# Altium project RP2040_ESP32-C3 Dev Board.PrjPcb
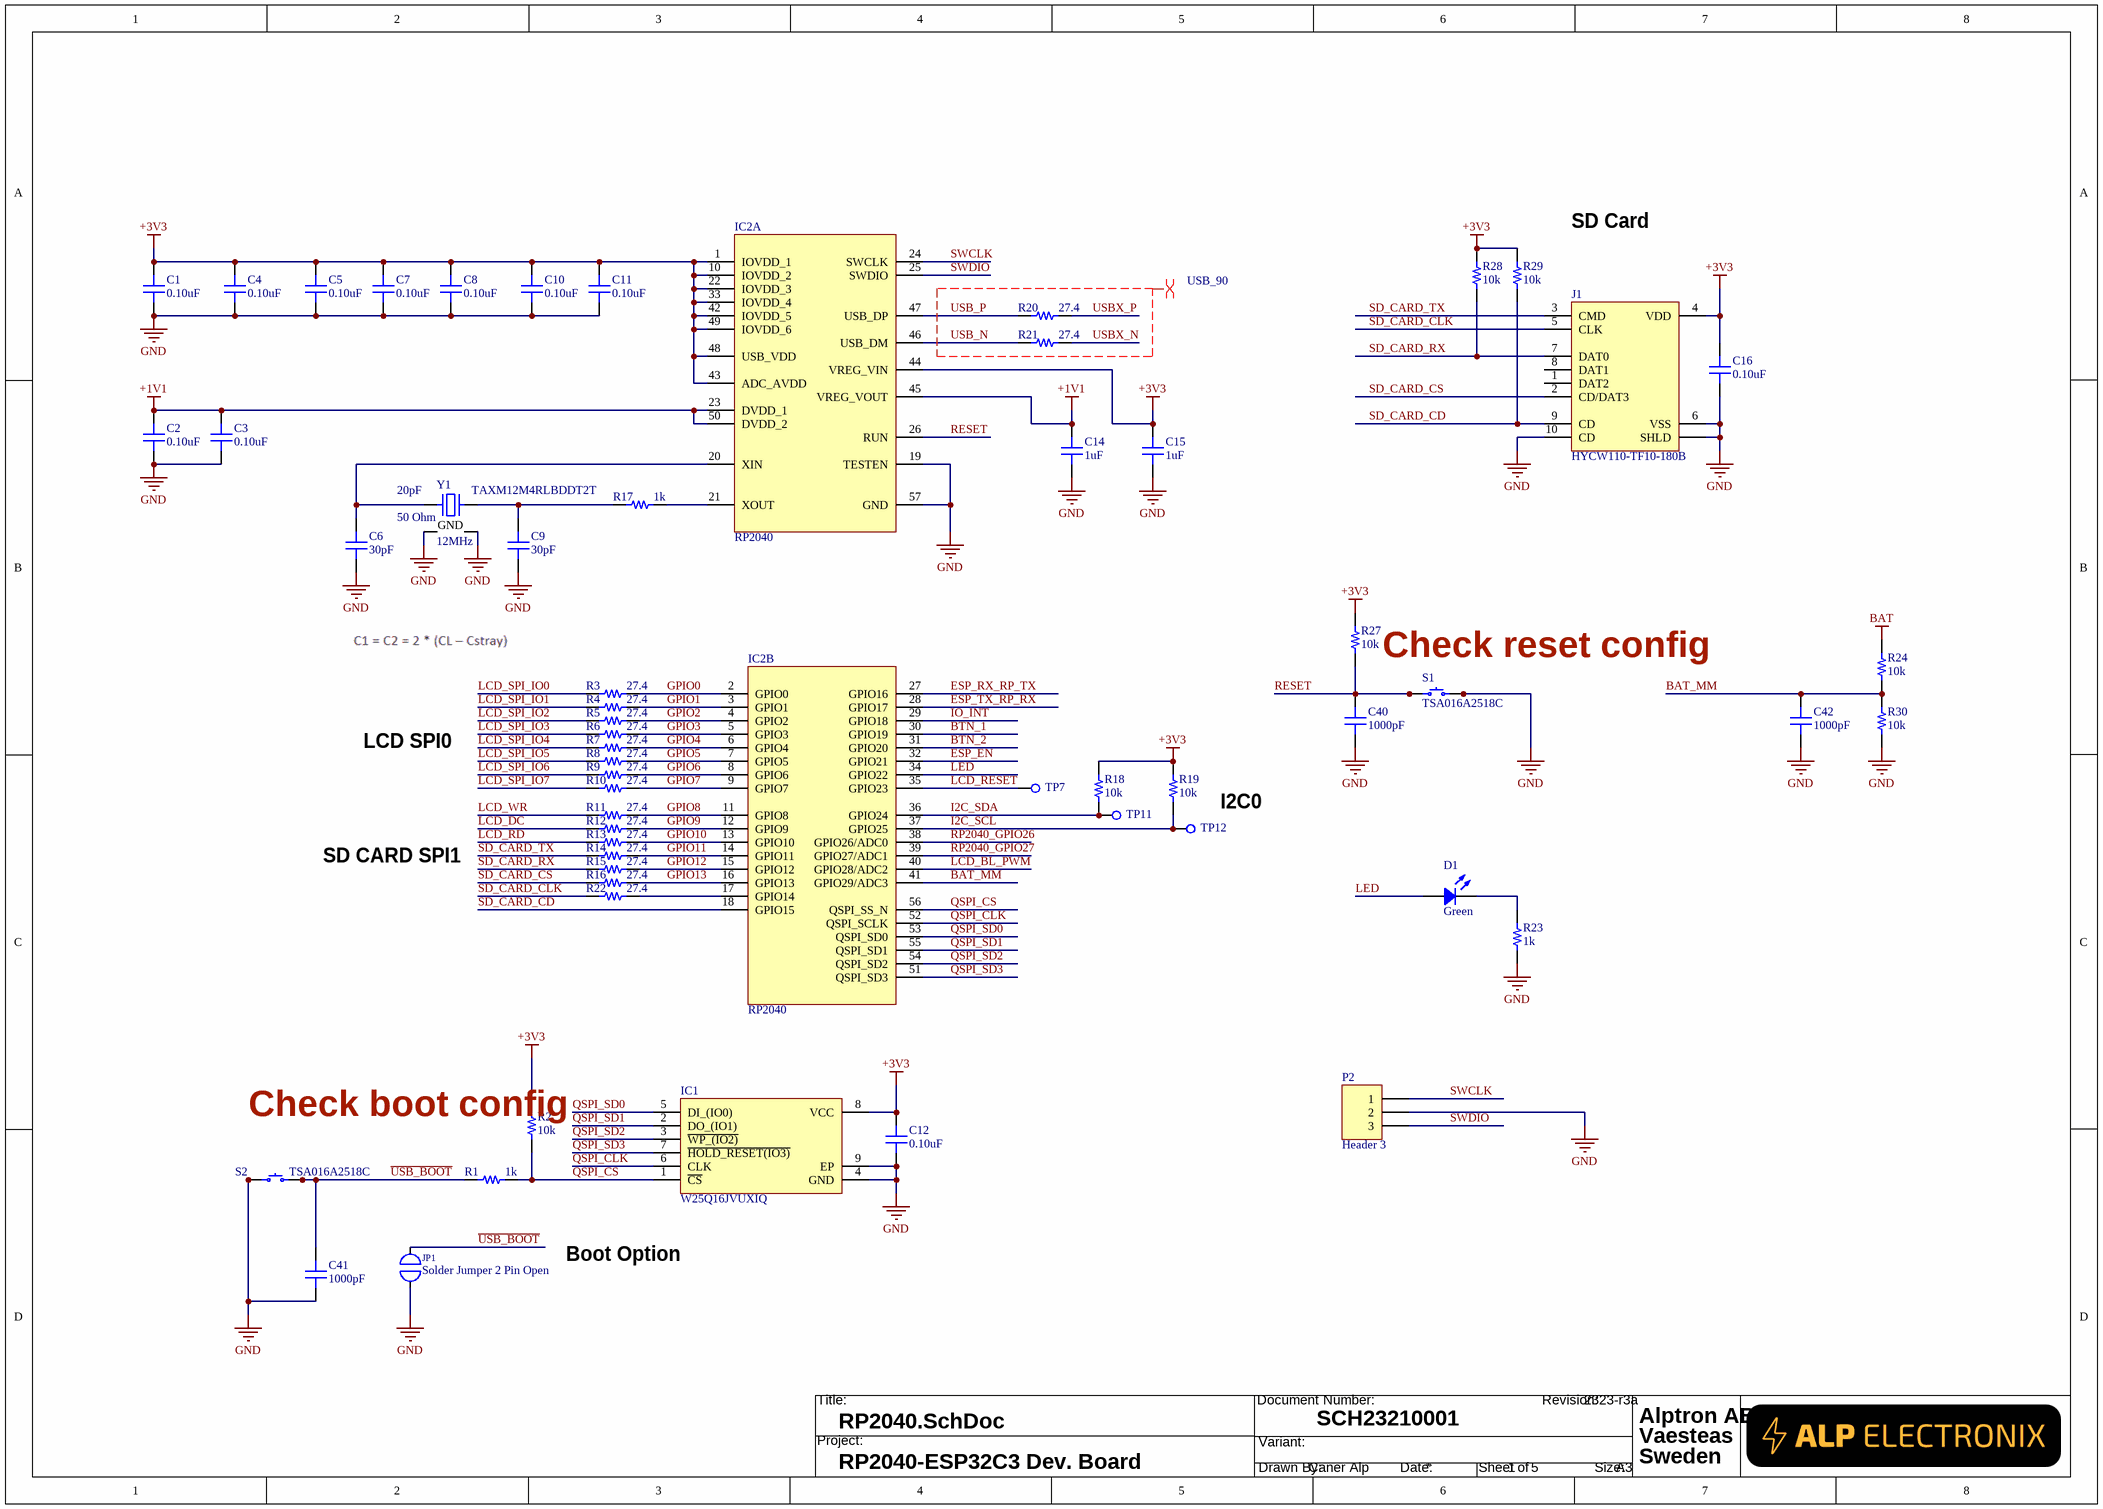
[diagram p0: RP2040.SchDoc]
DocumentCompanyNumber: SCH23210001; outputname: 4322-r1a; Project: RP2040-ESP32C3 Dev. Board; revision: 2323-r3a
5 sheets, 136 parts. Net scope: global (net labels, ports and power ports of the same name join across sheets).
Board files: RP2040_ESP32-C3 Dev Board.PcbDoc, RP2040_ESP32-C3 Dev Panel.PcbDoc, RP2040_ESP32-C3 Dev Board P&P.PcbDoc
Sheets:
  RP2040.SchDoc
  ESP32-C3 Module.SchDoc
  Power.SchDoc
  Interface.SchDoc
  Information.SchDoc

## Sheet RP2040.SchDoc
size A3; Author: Alptron AB; CompanyName: Alptron AB; DrawnBy: Caner Alp; Engineer: Caner Alp; Organization: Alptron AB; Address2: Vaesteas; Address4: Sweden; DocumentNumber: 1; SheetNumber: 1; SheetTotal: 5

### Parts
C1  0.10uF  [CAP 0402/1005]
C2  0.10uF  [CAP 0402/1005]
C3  0.10uF  [CAP 0402/1005]
C4  0.10uF  [CAP 0402/1005]
C5  0.10uF  [CAP 0402/1005]
C6  30pF  [CAP 0402/1005]
C7  0.10uF  [CAP 0402/1005]
C8  0.10uF  [CAP 0402/1005]
C9  30pF  [CAP 0402/1005]
C10  0.10uF  [CAP 0402/1005]
C11  0.10uF  [CAP 0402/1005]
C12  0.10uF  [CAP 0402/1005]
C14  1uF  [CAP 0402/1005]
C15  1uF  [CAP 0402/1005]
C16  0.10uF  [CAP 0402/1005]
C40  1000pF  [CAP 0402/1005]
C41  1000pF  [CAP 0402/1005]
C42  1000pF  [CAP 0402/1005]
D1  Green  [LED 0603/1608 GREEN]
IC1  W25Q16JVUXIQ  [SON50P300X200X60-9N]
IC2  RP2040  [QFN40P700X700X90-57N-D]  (parts A,B of 2)
J1  HYCW110-TF10-180B  [HYCW110-TF10-180B]
JP1  Solder Jumper 2 Pin Open  [SolderJumper-2_P1.3mm_Open_RoundedPad1.0x1.5mm]  (net tie, no BOM)
P2  Header 3  [3 Pads for SBW]
R1  1k  [RES 0402/1005]
R2  10k  [RES 0402/1005]
R3  27.4  [RES 0402/1005]
R4  27.4  [RES 0402/1005]
R5  27.4  [RES 0402/1005]
R6  27.4  [RES 0402/1005]
R7  27.4  [RES 0402/1005]
R8  27.4  [RES 0402/1005]
R9  27.4  [RES 0402/1005]
R10  27.4  [RES 0402/1005]
R11  27.4  [RES 0402/1005]
R12  27.4  [RES 0402/1005]
R13  27.4  [RES 0402/1005]
R14  27.4  [RES 0402/1005]
R15  27.4  [RES 0402/1005]
R16  27.4  [RES 0402/1005]
R17  1k  [RES 0402/1005]
R18  10k  [RES 0402/1005]
R19  10k  [RES 0402/1005]
R20  27.4  [RES 0402/1005]
R21  27.4  [RES 0402/1005]
R22  27.4  [RES 0402/1005]
R23  1k  [RES 0402/1005]
R24  10k  [RES 0402/1005]
R27  10k  [RES 0402/1005]
R28  10k  [RES 0402/1005]
R29  10k  [RES 0402/1005]
R30  10k  [RES 0402/1005]
S1  TSA016A2518C  [TSA016A2518C]
S2  TSA016A2518C  [TSA016A2518C]
TP7  RCT-0C  [TestPoint 1mm]  (value not drawn)  (no BOM)
TP11  RCT-0C  [TestPoint 1mm]  (value not drawn)  (no BOM)
TP12  RCT-0C  [TestPoint 1mm]  (value not drawn)  (no BOM)
Y1  12MHz  Part Number: TAXM12M4RLBDDT2T  Load Capacitance: 20pF  ESR: 50 Ohm  [NDK NX3225SA]

### Nets
+1V1: C2.2 C3.2 C14.2 IC2.23(DVDD_1) IC2.45(VREG_VOUT) IC2.50(DVDD_2)
+3V3: C1.2 C4.2 C5.2 C7.2 C8.2 C10.2 C11.2 C12.2 C15.2 C16.2 IC1.8(VCC) IC2.1(IOVDD_1) IC2.10(IOVDD_2) IC2.22(IOVDD_3) IC2.33(IOVDD_4) IC2.42(IOVDD_5) IC2.43(ADC_AVDD) IC2.44(VREG_VIN) IC2.48(USB_VDD) IC2.49(IOVDD_6) J1.4(VDD) R2.2 R18.2 R19.2 R27.2 R28.2 R29.2
BAT: R24.2
GND: C1.1 C2.1 C3.1 C4.1 C5.1 C6.1 C7.1 C8.1 C9.1 C10.1 C11.1 C12.1 C14.1 C15.1 C16.1 C40.1 C41.1 C42.1 IC1.4(GND) IC1.9(EP) IC2.19(TESTEN) IC2.57(GND) J1.6(VSS) J1.10(CD) J1.S(SHLD) JP1.1(A) P2.2 R23.1 R30.1 S1.3 S1.4 S2.1 S2.2 Y1.2(GND) Y1.4(GND)
~{USB_BOOT}: C41.2 JP1.2(B) R1.1 S2.3 S2.4
BAT_MM: C42.2 IC2.41(GPIO29/ADC3) R24.1 R30.2
BTN_1: IC2.30(GPIO19)
BTN_2: IC2.31(GPIO20)
ESP_EN: IC2.32(GPIO21)
ESP_RX_RP_TX: IC2.27(GPIO16)
ESP_TX_RP_RX: IC2.28(GPIO17)
GPIO0: IC2.2(GPIO0) R3.2
GPIO1: IC2.3(GPIO1) R4.2
GPIO2: IC2.4(GPIO2) R5.2
GPIO3: IC2.5(GPIO3) R6.2
GPIO4: IC2.6(GPIO4) R7.2
GPIO5: IC2.7(GPIO5) R8.2
GPIO6: IC2.8(GPIO6) R9.2
GPIO7: IC2.9(GPIO7) R10.2
GPIO8: IC2.11(GPIO8) R11.2
GPIO9: IC2.12(GPIO9) R12.2
GPIO10: IC2.13(GPIO10) R13.2
GPIO11: IC2.14(GPIO11) R14.2
GPIO12: IC2.15(GPIO12) R15.2
GPIO13: IC2.16(GPIO13) R16.2
I2C_SCL: IC2.37(GPIO25) R19.1 TP12.1(TP)
I2C_SDA: IC2.36(GPIO24) R18.1 TP11.1(TP)
IO_INT: IC2.29(GPIO18)
LCD_BL_PWM: IC2.40(GPIO28/ADC2)
LCD_DC: R12.1
LCD_RD: R13.1
LCD_RESET: IC2.35(GPIO23) TP7.1(TP)
LCD_SPI_IO0: R3.1
LCD_SPI_IO1: R4.1
LCD_SPI_IO2: R5.1
LCD_SPI_IO3: R6.1
LCD_SPI_IO4: R7.1
LCD_SPI_IO5: R8.1
LCD_SPI_IO6: R9.1
LCD_SPI_IO7: R10.1
LCD_WR: R11.1
LED: D1.1 IC2.34(GPIO22)
QSPI_CLK: IC1.6(CLK) IC2.52(QSPI_SCLK)
QSPI_CS: IC1.1(~{CS}) IC2.56(QSPI_SS_N) R1.2 R2.1
QSPI_SD0: IC1.5(DI_(IO0)) IC2.53(QSPI_SD0)
QSPI_SD1: IC1.2(DO_(IO1)) IC2.55(QSPI_SD1)
QSPI_SD2: IC1.3(~{WP_(IO2)}) IC2.54(QSPI_SD2)
QSPI_SD3: IC1.7(~{HOLD}~{_RESET(IO3)}) IC2.51(QSPI_SD3)
RESET: C40.2 IC2.26(RUN) R27.1 S1.1 S1.2
RP2040_GPIO26: IC2.38(GPIO26/ADC0)
RP2040_GPIO27: IC2.39(GPIO27/ADC1)
SD_CARD_CD: IC2.18(GPIO15) J1.9(CD) R29.1
SD_CARD_CLK: J1.5(CLK) R22.1
SD_CARD_CS: J1.2(CD/DAT3) R16.1
SD_CARD_RX: J1.7(DAT0) R15.1 R28.1
SD_CARD_TX: J1.3(CMD) R14.1
SWCLK: IC2.24(SWCLK) P2.1
SWDIO: IC2.25(SWDIO) P2.3
USB_N: IC2.46(USB_DM) R21.1
USB_P: IC2.47(USB_DP) R20.1
USBX_N: R21.2
USBX_P: R20.2
NetC6_2: C6.2 IC2.20(XIN) Y1.1
NetC9_2: C9.2 R17.1 Y1.3
NetD1_2: D1.2 R23.2
NetIC2_17: IC2.17(GPIO14) R22.2
NetIC2_21: IC2.21(XOUT) R17.2

Not connected (* = marked no-connect by the designer): J1 1(DAT2) 8(DAT1)

### Layout directives
differential pair; differential pair class USB_90: USB_N, USB_P, USBX_N, USBX_P

### Notes on the sheet
- SD Card
- Check reset config
- LCD SPI0
- I2C0
- SD CARD SPI1
- (near R2) Check boot config
- Boot Option
- Title:
- Project:
- Document Number:
- Variant:
- Revision:
- Drawn By:
- Date:
- Sheet
- of
- Size:
- A3

### Library data of the parts
C1-C5 C7 C8 C10-C12 C16 = LMK105BJ104KV-F: CAP CER 0.1UF 10V X5R 0402; Manufacturer: Taiyo Yuden; TemperatureRange: -55C ~ 85C; Tolerance: 10%; Value: 0.10uF; Part Number: LMK105BJ104KV-F; PartId: 12322; Supplier 1: Digi-Key; Supplier Part Number 1: 587-1227-2-ND; ComponentLink1Description: Datasheet; ComponentLink1URL: http://ds.yuden.co.jp/TYCOMPAS/ut/detail.do?productNo=LMK105BJ104KV-F&fileName=LMK105BJ104KV-F_SS&mode=specSheetDownload; ComponentLink2Description: Digi-Key Listing; ComponentLink2URL: https://www.digikey.com/product-detail/en/taiyo-yuden/LMK105BJ104KV-F/587-1227-2-ND/930579; TemperatureCoefficient: X5R; Voltage: 10V; Price: 0,0021; Device Package: 0402 (1005 Metric)
C6 C9 = GRM1555C1H300JA01D: CAP CER 30PF 50V NP0 0402; Manufacturer: Murata Electronics North America; TemperatureRange: -55C ~ 125C; TemperatureCoefficient: C0G, NP0; Tolerance: 5%; Value: 30pF; Part Number: GRM1555C1H300JA01D; PartId: 5055; Supplier 1: Digi-Key; Supplier Part Number 1: 490-5935-2-ND; ComponentLink1Description: Datasheet; ComponentLink1URL: http://www.murata.com/~/media/webrenewal/support/library/catalog/products/capacitor/mlcc/c02e.ashx; ComponentLink2Description: Digi-Key listing; ComponentLink2URL: http://digikey.com/product-detail/en/GRM1555C1H300JA01D/490-5935-2-ND/3693845; Voltage: 50V; Price: 0,0118; Type: -; Device Package: 0402 (1005 Metric)
C14 C15 = GRM155R70J105KA12D: CAP CER 1UF 6.3V X7R 0402; Manufacturer: Murata Electronics North America; TemperatureRange: -55C ~ 125C; Tolerance: 10%; Type: Derating Recommended; Value: 1uF; Part Number: GRM155R70J105KA12D; PartId: 5157; Supplier 1: Digi-Key; Supplier Part Number 1: 490-10024-2-ND; ComponentLink1Description: Datasheet; ComponentLink1URL: http://www.murata.com/~/media/webrenewal/support/library/catalog/products/capacitor/mlcc/c02e.ashx; ComponentLink2Description: Digi-Key listing; ComponentLink2URL: http://digikey.com/product-detail/en/GRM155R70J105KA12D/490-10024-2-ND/5027109; TemperatureCoefficient: X7R; Voltage: 6.3V; Price: 0,019; Device Package: 0402 (1005 Metric)
C40-C42 = C1005C0G1H102J050BA: CAP CER 1000PF 50V C0G 0402; Manufacturer: TDK Corporation; TemperatureRange: -55C ~ 125C; TemperatureCoefficient: C0G, NP0; Tolerance: 5%; Value: 1000pF; Part Number: C1005C0G1H102J050BA; PartId: 3861; Supplier 1: Digi-Key; Supplier Part Number 1: 445-6846-2-ND; ComponentLink1Description: Datasheet; ComponentLink1URL: https://product.tdk.com/info/en/catalog/datasheets/mlcc_commercial_general_en.pdf; ComponentLink2Description: Digi-Key listing; ComponentLink2URL: http://digikey.com/product-detail/en/C1005C0G1H102J050BA/445-6846-2-ND/2619187; Voltage: 50V; Price: 0,0287; Type: -; Device Package: 0402 (1005 Metric)
D1 = HSMQ-C191: LED GREEN DIFFUSED 0603 SMD; Manufacturer: Avago Technologies US Inc.; Type: Surface Mount; Millicandela: 145mcd; Voltage Forward: 3.4V; Current (Test): 20mA; Viewing Angle: 140; Value: Green; Part Number: HSMQ-C191; PartId: 7059; Supplier 1: Digi-Key; Supplier Part Number 1: 516-1807-2-ND; ComponentLink1Description: Datasheet; ComponentLink1URL: http://www.avagotech.com/docs/AV02-0977EN; ComponentLink2Description: Digi-Key Listing; ComponentLink2URL: http://www.digikey.ca/product-detail/en/HSMQ-C191/516-1807-2-ND/1012398; Price: 0,4769; Device Package: 0603 (1608 Metric); Colour: Green; Lens Transparency: Diffused
IC1 = W25Q16JVUXIQ: Integrated Circuit; Manufacturer_Name: Winbond; Datasheet Link: https://www.winbond.com/resource-files/w25q16jv%20spi%20revh%2004082019%20plus.pdf; Height: 0.6mm; Manufacturer_Part_Number: W25Q16JVUXIQ
IC2 = RP2040: Integrated Circuit; Manufacturer_Name: RASPBERRY-PI; Datasheet Link: https://datasheets.raspberrypi.org/rp2040/rp2040-datasheet.pdf; Height: 0.9mm; Manufacturer_Part_Number: RP2040
J1 = HYCW110-TF10-180B: MICRO SD PUSH/PUSH SMALL 8C; Manufacturer: SHOU HAN; Number of Positions: 9(8 + 1); Connector Type: Connector and Ejector; Part Number: HYCW110-TF10-180B; PartId: 9290; Supplier 1: LCSC; Supplier Part Number 1: C393941; ComponentLink1Description: Datasheet; ComponentLink1URL: https://datasheet.lcsc.com/szlcsc/1912111437_SHOU-HAN-TF-PUSH_C393941.pdf; ComponentLink2Description: LCSC Listing; ComponentLink2URL: https://lcsc.com/product-detail/Card-Sockets-Connectors_SHOU-HAN-TF-PUSH_C393941.html; Type: Connector and Ejector; Mounting Type: Surface Mount, Right Angle; Features: Switch; Contact Finish: Nickel
JP1 = SolderJumper_2_Open: ki_keywords: solder jumper SPST; ki_description: Solder Jumper, 2-pole, open; ki_fp_filters: SolderJumper*Open*; Supplier: ~
P2 = Header 3: Header, 3-Pin; LatestRevisionDate: 17-Jul-2002; LatestRevisionNote: Re-released for DXP Platform.; Publisher: Altium Limited
R1 R17 R23 = ERJ-2GEJ102X: RES SMD 1K OHM 5% 1/10W 0402; Manufacturer: Panasonic Electronic Components; TemperatureRange: -55C ~ 155C; TemperatureCoefficient: 200ppm/C; PowerRating: 0.1W, 1/10W; Value: 1k; Part Number: ERJ-2GEJ102X; PartId: 10982; Supplier 1: Digi-Key; Supplier Part Number 1: P1.0KJTR-ND; ComponentLink1Description: Datasheet; ComponentLink1URL: http://industrial.panasonic.com/www-cgi/jvcr13pz.cgi?E+PZ+3+AOA0001+ERJ2GEJ102X+7+WW; ComponentLink2Description: Digi-Key Listing; ComponentLink2URL: https://www.digikey.com/product-detail/en/panasonic-electronic-components/ERJ-2GEJ102X/P1.0KJTR-ND/146898; Tolerance: 5%; Price: 0,0019; Device Package: 0402 (1005 Metric)
R2 R18 R19 R24 R27-R30 = RC0402JR-0710KL: RES SMD 10K OHM 5% 1/16W 0402; Manufacturer: Yageo; TemperatureRange: -55C ~ 155C; TemperatureCoefficient: 100ppm/C; PowerRating: 0.063W, 1/16W; Value: 10k; Part Number: RC0402JR-0710KL; PartId: 14464; Supplier 1: Digi-Key; Supplier Part Number 1: 311-10KJRTR-ND; ComponentLink1Description: Datasheet; ComponentLink1URL: http://www.yageo.com/documents/recent/PYu-RC_Group_51_RoHS_L_04.pdf; ComponentLink2Description: Digi-Key Listing; ComponentLink2URL: https://www.digikey.com/product-detail/en/yageo/RC0402JR-0710KL/311-10KJRTR-ND/726418; Tolerance: 5%; Price: 0,0017; Device Package: 0402 (1005 Metric)
R3-R16 R20-R22 = ERJ-2RKF27R4X: RES SMD 27.4 OHM 1% 1/10W 0402; Manufacturer: Panasonic Electronic Components; TemperatureRange: -55C ~ 155C; TemperatureCoefficient: 100ppm/C; PowerRating: 0.1W, 1/10W; Value: 27.4; Part Number: ERJ-2RKF27R4X; PartId: 342; Supplier 1: Digi-Key; Supplier Part Number 1: P27.4LTR-ND; ComponentLink1Description: Datasheet; ComponentLink1URL: http://industrial.panasonic.com/www-cgi/jvcr13pz.cgi?E+PZ+3+AOA0002+ERJ2RKF27R4X+7+WW; ComponentLink2Description: Digikey listing; ComponentLink2URL: http://digikey.com/product-detail/en/ERJ-2RKF27R4X/P27.4LTR-ND/192262; Tolerance: 1%; Price: 0,0043; Type: Thick Film; Device Package: 0402 (1005 Metric)
S1 S2 = PTS810 SJM 250 SMTR LFS: SWITCH TACTILE SPST-NO 0.05A 16V; Manufacturer: C&K; Actuator Height off PCB, Vertical: 2.50mm; Actuator Orientation: Top Actuated; Actuator Type: Oval Button; Contact Rating @ Voltage: 0.05A @ 16VDC; Illumination: Non-Illuminated; Operating Force: 160gf; Outline: 4.20mm x 3.20mm; Switch Function: Off-Mom; Part Number: TSA016A2518C; Circuit: SPST-NO; ComponentLink1Description: Datasheet; ComponentLink1URL: https://dznh3ojzb2azq.cloudfront.net/products/Tactile/PTS810/documents/datasheet.pdf; ComponentLink2Description: DigiKey Link; ComponentLink2URL: http://digikey.com/product-detail/en/c-k/PTS810-SJM-250-SMTR-LFS/CKN10502CT-ND/4176673; LastUpdated: 2020-04-09 10:00:13; Lifecycle Status: Active; Minimum Order: 1; Mounting Type: Surface Mount; Operating Temperature: -40°C ~ 85°C; Packaging: TapeAndReel; Part Status: Active; Price: 0.16; Series: PTS810; Supplier 1: DigiKey; Supplier Part Number 1: CKN10502CT-ND; Termination Style: J Lead
TP7 TP11 TP12 = RCT-0C: 0805 PROBE PAD; Manufacturer: TE Connectivity AMP Connectors; Part Number: RCT-0C; PartId: 15704; Supplier 1: Digi-Key; Supplier Part Number 1: A106144CT-ND; ComponentLink1Description: Datasheet; ComponentLink1URL: http://www.te.com/commerce/DocumentDelivery/DDEController?Action=srchrtrv&DocNm=1773266&DocType=DS&DocLang=English; ComponentLink2Description: Digi-Key Listing; ComponentLink2URL: http://www.digikey.com/product-detail/en/te-connectivity-amp-connectors/RCT-0C/A106144CT-ND/3477801; Price: 0,14; Type: PC Test Point; Mounting Type: Surface Mount
Y1 = NX3225SA-12.000MHZ-STD-CSR-1: CRYSTAL 12.0000MHZ 8PF SMD; Manufacturer: NDK; Frequency Stability: 15ppm; Operating Mode: Fundamental; PartId: 8505; Supplier 1: LCSC; Supplier Part Number 1: 644-1047-2-ND; ComponentLink1Description: Datasheet; ComponentLink1URL: http://media.digikey.com/pdf/Data%20Sheets/NDK%20PDFs/NX3225SA.pdf; ComponentLink2Description: Digi-Key Listing; ComponentLink2URL: http://www.digikey.com/product-detail/en/NX3225SA-12.000MHZ-STD-CSR-1/644-1047-2-ND/1128829; Price: 0,3799; Type: MHz Crystal; Device Package: 4-SMD, No Lead (DFN, LCC); Frequency: 12MHz; Frequency Tolerance: 15ppm

## Sheet ESP32-C3 Module.SchDoc
size A3; Author: Alptron AB; CompanyName: Alptron AB; DrawnBy: Caner Alp; Engineer: Caner Alp; Organization: Alptron AB; Address2: Vaesteas; Address4: Sweden; DocumentNumber: 2; SheetNumber: 2; SheetTotal: 5
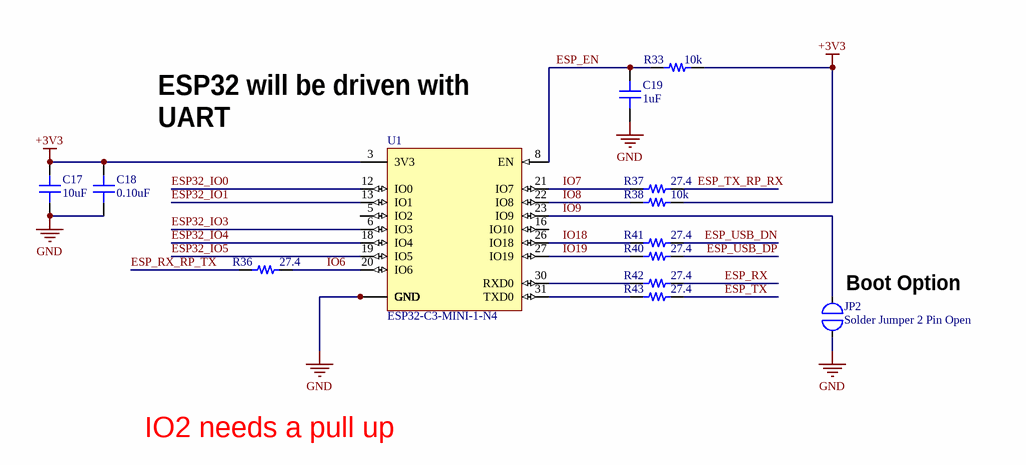
[diagram p1: ESP32-C3 Module.SchDoc]

### Parts
C17  10uF  [CAP 0603/1608]
C18  0.10uF  [CAP 0402/1005]
C19  1uF  [CAP 0402/1005]
JP2  Solder Jumper 2 Pin Open  [SolderJumper-2_P1.3mm_Open_RoundedPad1.0x1.5mm]  (net tie, no BOM)
R33  10k  [RES 0402/1005]
R36  27.4  [RES 0402/1005]
R37  27.4  [RES 0402/1005]
R38  10k  [RES 0402/1005]
R40  27.4  [RES 0402/1005]
R41  27.4  [RES 0402/1005]
R42  27.4  [RES 0402/1005]
R43  27.4  [RES 0402/1005]
U1  ESP32-C3-MINI-1-N4  [XCVR_ESP32-C3-MINI-1-N4]

### Nets
+3V3: C17.2 C18.2 R33.2 R38.2 U1.3(3V3)
GND: C17.1 C18.1 C19.1 JP2.1(A) U1.1(GND) U1.2(GND) U1.11(GND) U1.14(GND) U1.36(GND) U1.37(GND) U1.38(GND) U1.39(GND) U1.40(GND) U1.41(GND) U1.42(GND) U1.43(GND) U1.44(GND) U1.45(GND) U1.46(GND) U1.47(GND) U1.48(GND) U1.49_1(GND) U1.49_2(GND) U1.49_3(GND) U1.49_4(GND) U1.49_5(GND) U1.49_6(GND) U1.49_7(GND) U1.49_8(GND) U1.49_9(GND) U1.50(GND) U1.51(GND) U1.52(GND) U1.53(GND)
ESP32_IO0: U1.12(IO0)
ESP32_IO1: U1.13(IO1)
ESP32_IO3: U1.6(IO3)
ESP32_IO4: U1.18(IO4)
ESP32_IO5: U1.19(IO5)
ESP_EN: C19.2 R33.1 U1.8(EN)
ESP_RX: R42.2
ESP_RX_RP_TX: R36.1
ESP_TX: R43.2
ESP_TX_RP_RX: R37.2
ESP_USB_DN: R41.2
ESP_USB_DP: R40.2
IO6: R36.2 U1.20(IO6)
IO7: R37.1 U1.21(IO7)
IO8: R38.1 U1.22(IO8)
IO9: JP2.2(B) U1.23(IO9)
IO18: R41.1 U1.26(IO18)
IO19: R40.1 U1.27(IO19)
NetR42_1: R42.1 U1.30(RXD0)
NetR43_1: R43.1 U1.31(TXD0)

Not connected (* = marked no-connect by the designer): U1 4(NC) 5(IO2) 7(NC) 9(NC) 10(NC) 15(NC) 16(IO10) 17(NC) 24(NC) 25(NC) 28(NC) 29(NC) 32(NC) 33(NC) 34(NC) 35(NC)

### Notes on the sheet
- (near U1) ESP32 will be driven with UART
- (near JP2) Boot Option
- IO2 needs a pull up
- Title:
- Project:
- Document Number:
- Variant:
- Revision:
- Drawn By:
- Date:
- Sheet
- of
- Size:
- A3

### Library data of the parts
C17 = GRM188R60J106ME47D: CAP CER 10UF 6.3V X5R 0603; Manufacturer: Murata Electronics North America; TemperatureRange: -55C ~ 85C; Tolerance: 20%; Value: 10uF; Part Number: GRM188R60J106ME47D; PartId: 12950; Supplier 1: Digi-Key; Supplier Part Number 1: 490-3896-2-ND; ComponentLink1Description: Datasheet; ComponentLink1URL: http://www.murata.com/~/media/webrenewal/support/library/catalog/products/capacitor/mlcc/c02e.pdf; ComponentLink2Description: Digi-Key Listing; ComponentLink2URL: https://www.digikey.com/product-detail/en/murata-electronics-north-america/GRM188R60J106ME47D/490-3896-2-ND/965910; TemperatureCoefficient: X5R; Voltage: 6.3V; Price: 0,031; Device Package: 0603 (1608 Metric)
C18 = LMK105BJ104KV-F: as C1 on sheet RP2040; Value: 0.10uF; Part Number: LMK105BJ104KV-F; PartId: 12322; Supplier 1: Digi-Key; Supplier Part Number 1: 587-1227-2-ND; ComponentLink1Description: Datasheet; ComponentLink1URL: http://ds.yuden.co.jp/TYCOMPAS/ut/detail.do?productNo=LMK105BJ104KV-F&fileName=LMK105BJ104KV-F_SS&mode=specSheetDownload; ComponentLink2Description: Digi-Key Listing; ComponentLink2URL: https://www.digikey.com/product-detail/en/taiyo-yuden/LMK105BJ104KV-F/587-1227-2-ND/930579; TemperatureCoefficient: X5R; Voltage: 10V; Price: 0,0021; Device Package: 0402 (1005 Metric)
C19 = GRM155R70J105KA12D: as C14 on sheet RP2040; Value: 1uF; Part Number: GRM155R70J105KA12D; PartId: 5157; Supplier 1: Digi-Key; Supplier Part Number 1: 490-10024-2-ND; ComponentLink1Description: Datasheet; ComponentLink1URL: http://www.murata.com/~/media/webrenewal/support/library/catalog/products/capacitor/mlcc/c02e.ashx; ComponentLink2Description: Digi-Key listing; ComponentLink2URL: http://digikey.com/product-detail/en/GRM155R70J105KA12D/490-10024-2-ND/5027109; TemperatureCoefficient: X7R; Voltage: 6.3V; Price: 0,019; Device Package: 0402 (1005 Metric)
JP2 = SolderJumper_2_Open: as JP1 on sheet RP2040; Supplier: ~
R33 R38 = RC0402JR-0710KL: as R2 on sheet RP2040; Value: 10k; Part Number: RC0402JR-0710KL; PartId: 14464; Supplier 1: Digi-Key; Supplier Part Number 1: 311-10KJRTR-ND; ComponentLink1Description: Datasheet; ComponentLink1URL: http://www.yageo.com/documents/recent/PYu-RC_Group_51_RoHS_L_04.pdf; ComponentLink2Description: Digi-Key Listing; ComponentLink2URL: https://www.digikey.com/product-detail/en/yageo/RC0402JR-0710KL/311-10KJRTR-ND/726418; Tolerance: 5%; Price: 0,0017; Device Package: 0402 (1005 Metric)
R36 R37 R40-R43 = ERJ-2RKF27R4X: as R3 on sheet RP2040; Value: 27.4; Part Number: ERJ-2RKF27R4X; PartId: 342; Supplier 1: Digi-Key; Supplier Part Number 1: P27.4LTR-ND; ComponentLink1Description: Datasheet; ComponentLink1URL: http://industrial.panasonic.com/www-cgi/jvcr13pz.cgi?E+PZ+3+AOA0002+ERJ2RKF27R4X+7+WW; ComponentLink2Description: Digikey listing; ComponentLink2URL: http://digikey.com/product-detail/en/ERJ-2RKF27R4X/P27.4LTR-ND/192262; Tolerance: 1%; Price: 0,0043; Type: Thick Film; Device Package: 0402 (1005 Metric)
U1 = ESP32-C3-MINI-1-N4: Bluetooth, WiFi 802.11b/g/n, Bluetooth v5.0 Transceiver Module 2.412GHz ~ 2.484GHz PCB Trace Surface Mount; MF: Espressif Systems; Purchase-URL: https://pricing.snapeda.com/search/part/ESP32-C3-MINI-1-N4/?ref=eda; Value: *; Package: SMD-53 Espressif Systems; Check_prices: https://www.snapeda.com/parts/ESP32-C3-MINI-1-N4/Espressif+Systems/view-part/?ref=eda; Price: None; Availability: In Stock; MP: ESP32-C3-MINI-1-N4; SnapEDA_Link: https://www.snapeda.com/parts/ESP32-C3-MINI-1-N4/Espressif+Systems/view-part/?ref=snap

## Sheet Power.SchDoc
size A3; Author: Alptron AB; CompanyName: Alptron AB; DrawnBy: Caner Alp; Engineer: Caner Alp; Organization: Alptron AB; Address2: Vasteras; Address4: Sweden; SheetNumber: 3; SheetTotal: 5
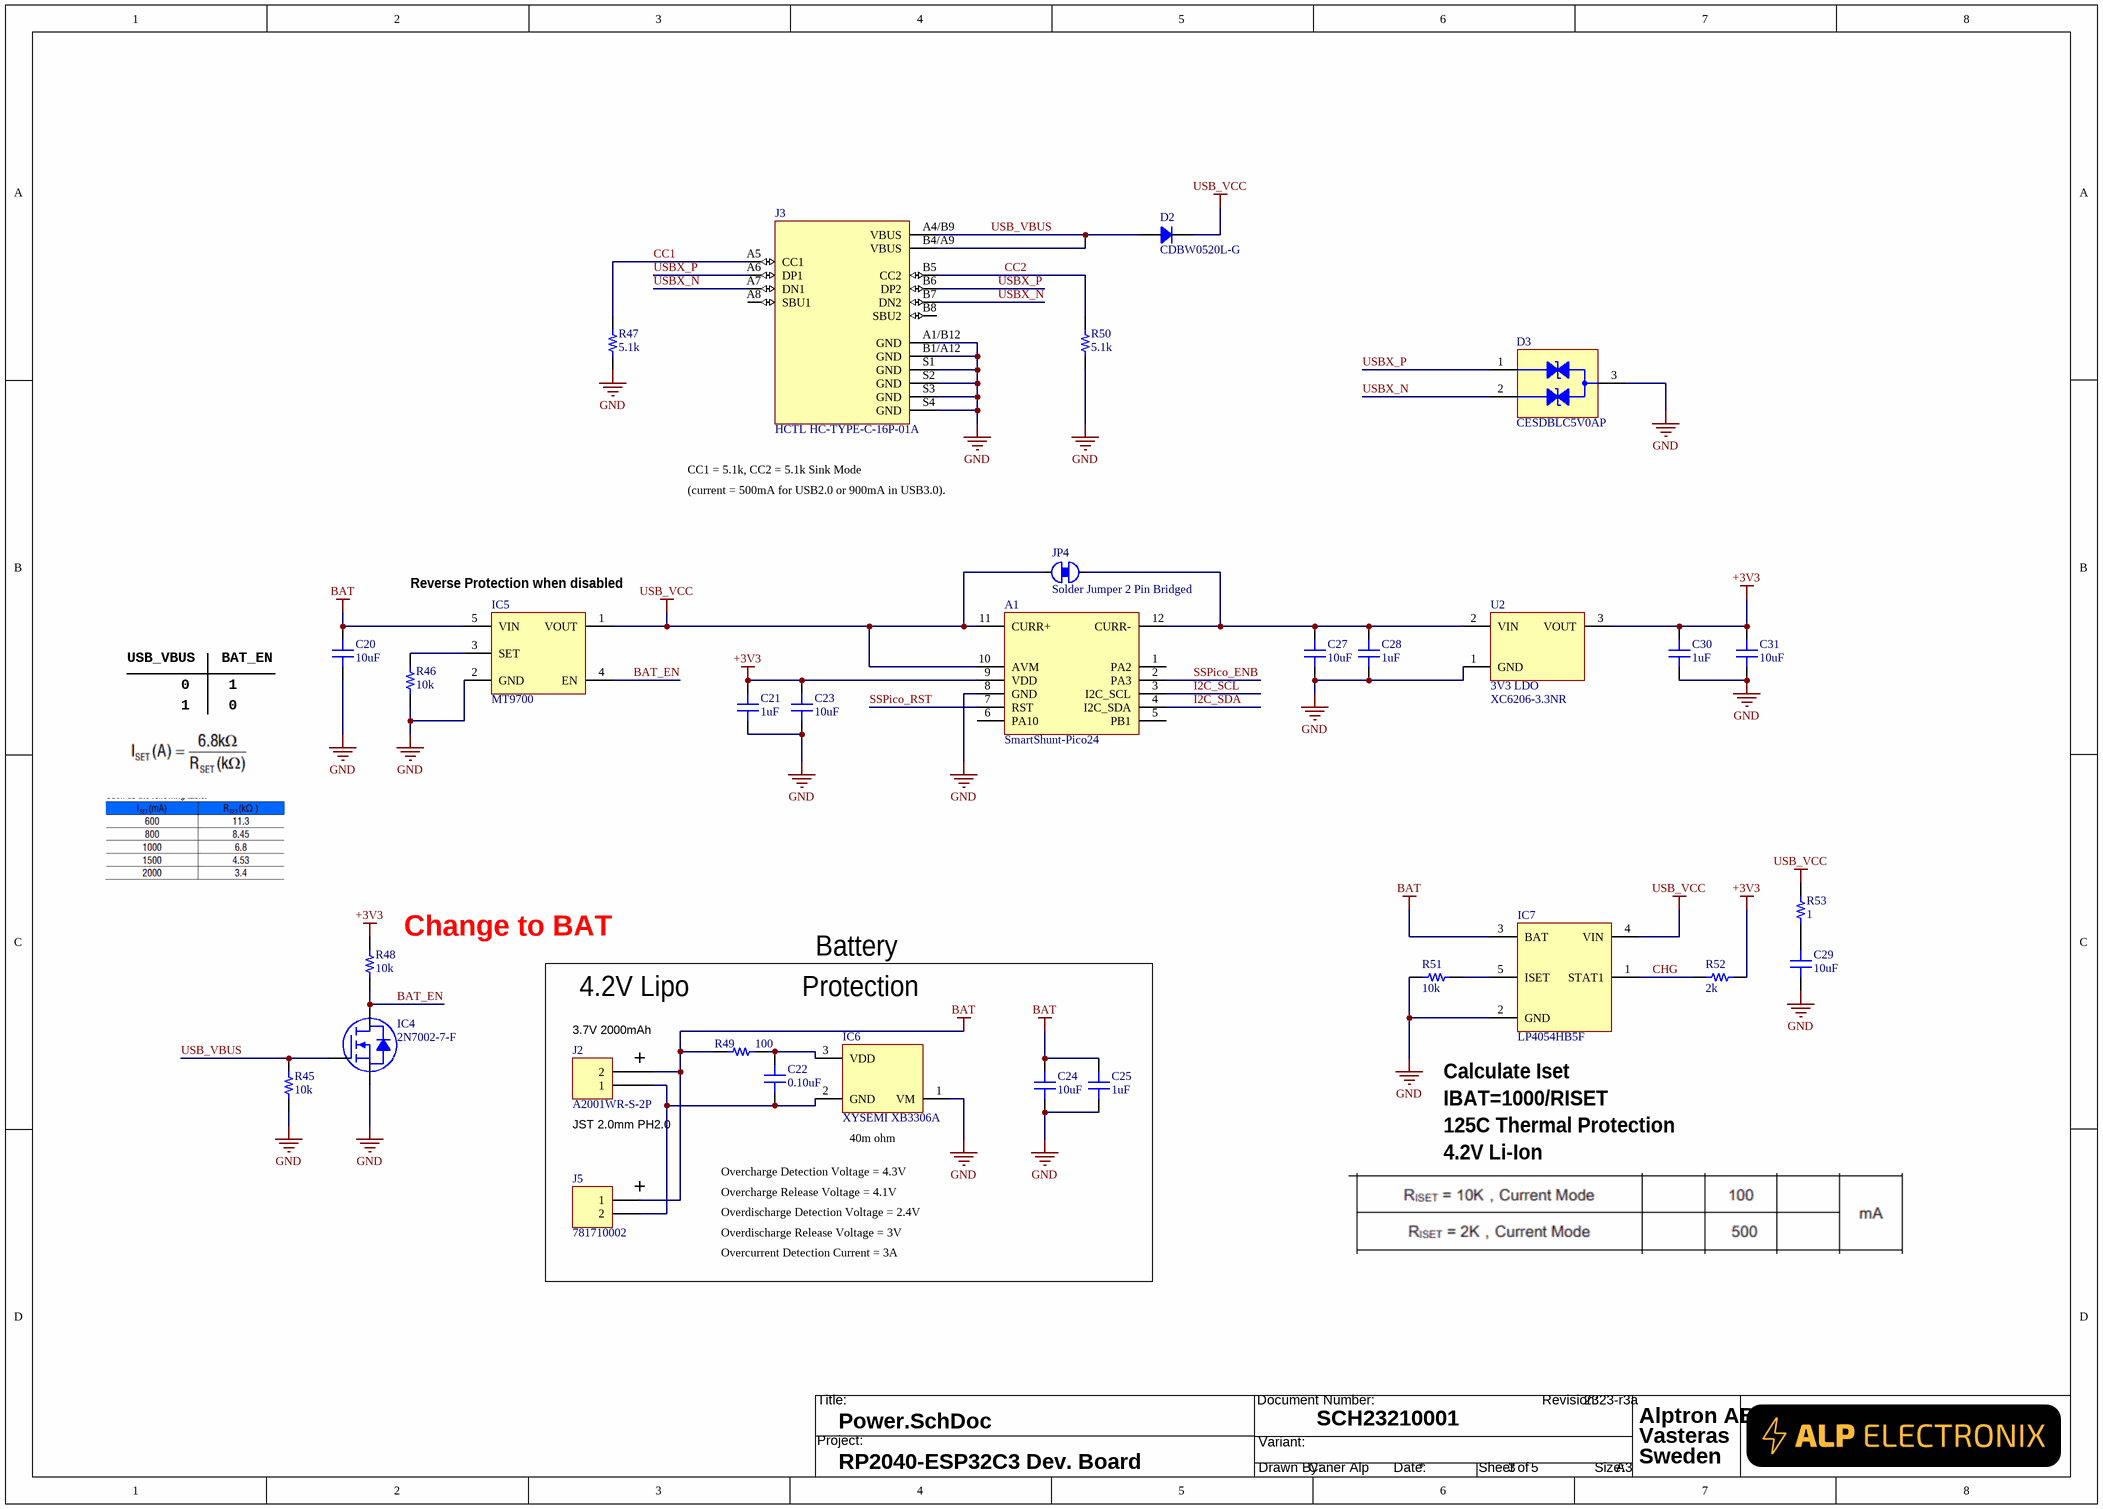
[diagram p2: Power.SchDoc]

### Parts
A1  SmartShunt-Pico24  [SmartShunt-Pico24]
C20  10uF  [CAP 0603/1608]
C21  1uF  [CAP 0402/1005]
C22  0.10uF  [CAP 0402/1005]
C23  10uF  [CAP 0603/1608]
C24  10uF  [CAP 0603/1608]
C25  1uF  [CAP 0402/1005]
C27  10uF  [CAP 0603/1608]
C28  1uF  [CAP 0402/1005]
C29  10uF  [CAP 0603/1608]
C30  1uF  [CAP 0402/1005]
C31  10uF  [CAP 0603/1608]
D2  CDBW0520L-G  [SOD-123]
D3  CESDBLC5V0AP  [ON SEMI SOT-23-3]
IC4  2N7002-7-F  [DIODES SOT-23-3]
IC5  MT9700  [DIODES SOT-23-5 W5]
IC6  XYSEMI XB3306A  [DIODES SOT-23-3]
IC7  LP4054HB5F  [DIODES SOT-23-5 W5]
J2  A2001WR-S-2P  [JST S2B-PH-SM4-TB]
J3  HCTL HC-TYPE-C-16P-01A  [HCTL HC-TYPE-C-16P-01A]
J5  781710002  [Molex 781710002]
JP4  Solder Jumper 2 Pin Bridged  [SolderJumper-2_P1.3mm_Bridged_RoundedPad1.0x1.5mm]  (net tie, no BOM)
R45  10k  [RES 0402/1005]
R46  10k  [RES 0603/1608]
R47  5.1k  [RES 0402/1005]
R48  10k  [RES 0402/1005]
R49  100  [RES 0402/1005]
R50  5.1k  [RES 0402/1005]
R51  10k  [RES 0603/1608]
R52  2k  [RES 0402/1005]
R53  1  [RES 0402/1005]
U2  3V3 LDO  [DIODES SOT-23-3]

### Nets
+3V3: A1.9(VDD) C21.2 C23.2 C30.2 C31.2 R48.2 R52.2 U2.3(VOUT)
BAT: C20.2 C24.2 C25.2 IC5.5(VIN) IC7.3(BAT) J2.2 J5.1 R49.1
GND: A1.8(GND) C20.1 C21.1 C23.1 C24.1 C25.1 C27.1 C28.1 C29.1 C30.1 C31.1 D3.3(I/O_2) IC4.3(S) IC5.2(GND) IC6.1(VM) IC7.2(GND) J3.A1/B12(GND) J3.B1/A12(GND) J3.S1(GND) J3.S2(GND) J3.S3(GND) J3.S4(GND) R45.1 R46.1 R47.1 R50.1 R51.1 U2.1(GND)
USB_VCC: A1.10(AVM) A1.11(CURR+) D2.2 IC5.1(VOUT) IC7.4(VIN) JP4.1(A) R53.2
BAT_EN: IC4.2(D) IC5.4(EN) R48.1
CC1: J3.A5(CC1) R47.2
CC2: J3.B5(CC2) R50.2
CHG: IC7.1(STAT1) R52.1
I2C_SCL: A1.3(I2C_SCL)
I2C_SDA: A1.4(I2C_SDA)
SSPico_ENB: A1.2(PA3)
SSPico_RST: A1.7(RST)
USB_VBUS: D2.1 IC4.1(G) J3.A4/B9(VBUS) J3.B4/A9(VBUS) R45.2
USBX_N: D3.2(GND) J3.A7(DN1) J3.B7(DN2)
USBX_P: D3.1(I/O_1) J3.A6(DP1) J3.B6(DP2)
NetA1_12: A1.12(CURR-) C27.2 C28.2 JP4.2(B) U2.2(VIN)
NetC22_1: C22.1 IC6.2(GND) J2.1 J5.2
NetC22_2: C22.2 IC6.3(VDD) R49.2
NetC29_2: C29.2 R53.1
NetIC5_3: IC5.3(SET) R46.2
NetIC7_5: IC7.5(ISET) R51.2

Not connected (* = marked no-connect by the designer): A1 1(PA2) 5(PB1) 6(PA10); J3 A8(SBU1) B8(SBU2)

### Notes on the sheet
- (current = 500mA for USB2.0 or 900mA in USB3.0).
- CC1 = 5.1k, CC2 = 5.1k Sink Mode
- (near IC5) Reverse Protection when disabled
- USB_VBUS
- 0
- 1
- BAT_EN
- (near R48) Change to BAT
- Battery
- (near J2) 3.7V 2000mAh
- 4.2V Lipo
- Protection
- (near J2) JST 2.0mm PH2.0
- (near J2) +
- (near IC7) Calculate Iset
- IBAT=1000/RISET
- Overcharge Detection Voltage = 4.3V
- (near IC6) 40m ohm
- 125C Thermal Protection
- 4.2V Li-Ion
- (near J5) +
- Overdischarge Detection Voltage = 2.4V
- Overcharge Release Voltage = 4.1V
- Overdischarge Release Voltage = 3V
- Overcurrent Detection Current = 3A
- Title:
- Project:
- Document Number:
- Variant:
- Revision:
- Drawn By:
- Date:
- Sheet
- of
- Size:
- A3

### Library data of the parts
A1 = SmartShunt-Pico24: Current Measurement Module
C20 C23 C24 C27 C29 C31 = GRM188R60J106ME47D: as C17 on sheet ESP32-C3 Module; Value: 10uF; Part Number: GRM188R60J106ME47D; PartId: 12950; Supplier 1: Digi-Key; Supplier Part Number 1: 490-3896-2-ND; ComponentLink1Description: Datasheet; ComponentLink1URL: http://www.murata.com/~/media/webrenewal/support/library/catalog/products/capacitor/mlcc/c02e.pdf; ComponentLink2Description: Digi-Key Listing; ComponentLink2URL: https://www.digikey.com/product-detail/en/murata-electronics-north-america/GRM188R60J106ME47D/490-3896-2-ND/965910; TemperatureCoefficient: X5R; Voltage: 6.3V; Price: 0,031; Device Package: 0603 (1608 Metric)
C21 C25 C28 C30 = GRM155R70J105KA12D: as C14 on sheet RP2040; Value: 1uF; Part Number: GRM155R70J105KA12D; PartId: 5157; Supplier 1: Digi-Key; Supplier Part Number 1: 490-10024-2-ND; ComponentLink1Description: Datasheet; ComponentLink1URL: http://www.murata.com/~/media/webrenewal/support/library/catalog/products/capacitor/mlcc/c02e.ashx; ComponentLink2Description: Digi-Key listing; ComponentLink2URL: http://digikey.com/product-detail/en/GRM155R70J105KA12D/490-10024-2-ND/5027109; TemperatureCoefficient: X7R; Voltage: 6.3V; Price: 0,019; Device Package: 0402 (1005 Metric)
C22 = LMK105BJ104KV-F: as C1 on sheet RP2040; Value: 0.10uF; Part Number: LMK105BJ104KV-F; PartId: 12322; Supplier 1: Digi-Key; Supplier Part Number 1: 587-1227-2-ND; ComponentLink1Description: Datasheet; ComponentLink1URL: http://ds.yuden.co.jp/TYCOMPAS/ut/detail.do?productNo=LMK105BJ104KV-F&fileName=LMK105BJ104KV-F_SS&mode=specSheetDownload; ComponentLink2Description: Digi-Key Listing; ComponentLink2URL: https://www.digikey.com/product-detail/en/taiyo-yuden/LMK105BJ104KV-F/587-1227-2-ND/930579; TemperatureCoefficient: X5R; Voltage: 10V; Price: 0,0021; Device Package: 0402 (1005 Metric)
D2 = CDBW0520L-G: DIODE SCHOTTKY 20V 500MA SOD123; Manufacturer: Comchip Technology; Current - Reverse Leakage @ Vr: 250 µA @ 20 V; Speed: Fast Recovery =< 500ns, > 200mA (Io); Voltage - Forward (Vf) (Max) @ If: 385 mV @ 500 mA; Part Number: CDBW0520L-G; ComponentLink1Description: Datasheet; ComponentLink1URL: http://www.comchiptech.com/admin/files/product/CDBW0520L-HF Thru824572. CDBW0540-HF RevA.pdf; ComponentLink2Description: DigiKey Link; ComponentLink2URL: https://www.digikey.com/en/products/detail/comchip-technology/CDBW0520L-G/1979670; Current - Average Rectified (Io): 500mA; Diode Type: Schottky; LastUpdated: 2022-06-30 22:48:20; Lifecycle Status: Active; Minimum Order: 1; Mounting Type: Surface Mount; Operating Temperature - Junction: 125°C (Max); Package / Case: SOD-123; Packaging: TapeAndReel; PartId: 2251; Part Status: Active; Price: 0.07; Series: -; Supplier 1: DigiKey; Supplier Part Number 1: 641-1326-1-ND; Supplier Device Package: SOD-123; Voltage - DC Reverse (Vr) (Max): 20 V
D3 = NUP2105LT1G: TVS DIODE 24V 44V SOT23-3; Manufacturer: ON Semiconductor; Bidirectional Channels: 2; Capacitance @ Frequency: 30pF @ 1MHz; Current - Peak Pulse (10/1000µs): 8A (8/20µs); Power Line Protection: No; Power - Peak Pulse: 350W; Type: Zener; Voltage - Breakdown (Min): 26.2V; Voltage - Reverse Standoff (Typ): 24V (Min); Part Number: CESDBLC5V0AP; Applications: General Purpose; ComponentLink1Description: Datasheet; ComponentLink1URL: http://www.onsemi.com/pub/Collateral/NUP2105L-D.PDF; ComponentLink2Description: DigiKey Link; ComponentLink2URL: http://digikey.com/product-detail/en/on-semiconductor/NUP2105LT1G/NUP2105LT1GOSCT-ND/1485001; Device Package: TO-236-3, SC-59, SOT-23-3; LastUpdated: 2020-03-30 16:33:57; Lifecycle Status: Active; Minimum Order: 1; Mounting Type: Surface Mount; Operating Temperature: -55°C ~ 150°C (TJ); Package / Case: TO-236-3, SC-59, SOT-23-3; Packaging: TapeAndReel; PartId: 10506; Part Status: Active; Price: 0.09; Series: -; Supplier 1: DigiKey; Supplier Part Number 1: NUP2105LT1GOSCT-ND; Supplier Device Package: SOT-23-3 (TO-236); Voltage - Clamping (Max) @ Ipp: 44V
IC4 = 2N7002-7-F: MOSFET N-CH 60V 115MA SOT23-3; Manufacturer: Diodes Incorporated; Rds On (Max) at Id, Vgs: 7.5 Ohm @ 50mA, 5V; Vgs(th) (Max) at Id: 2.5V @ 250uA; Input Capacitance (Ciss) at Vds: 50pF @ 25V; Power - Max: 370mW; Current Continuous Drain: 115mA (Ta); Part Number: 2N7002-7-F; PartId: 7967; Supplier 1: Digi-Key; Supplier Part Number 1: 2N7002-FDITR-ND; ComponentLink1Description: Datasheet; ComponentLink1URL: http://www.diodes.com/_files/datasheets/ds11303.pdf; ComponentLink2Description: Digi-Key Listing; ComponentLink2URL: http://www.digikey.com/product-detail/en/2N7002-7-F/2N7002-FDITR-ND/717681; Price: 0,0255; Type: MOSFET N-Channel, Metal Oxide; Device Package: TO-236-3, SC-59, SOT-23-3; Gate Charge (Qg): -; Drain to Source Voltage (Vdss): 60V; Features: Standard
IC5 = MT9700: SOT-23-5 Power Distribution Switches ROHS
IC6 = XYSEMI XB3306A: IC LITHIUM BATT PROTECT SOT23-3; Function: Protection; Battery Chemistry: Li-Ion, Li-Pol; Part Number: XYSEMI XB3306A; PartId: 16446; Manufacturer: XYSEMI; Supplier 1: LCSC; Supplier Part Number 1: C154939; ComponentLink1Description: Datasheet; ComponentLink1URL: http://www.baitaishengshi.com/uploadfile/2017/1213/20171213368970.pdf; ComponentLink2Description: LCSC Listing; ComponentLink2URL: https://lcsc.com/product-detail/Battery-Protection-ICs_XB3306A_C154939.html; Device Package: SOT-23-3
IC7 = LP4054HB5F: 600mA Standalone Linear Li-Ion Battery Charger
J2 = S2B-PH-SM4-TB(LF)(SN): CONN HEADER SMD R/A 2POS 2MM; Manufacturer: JST Sales America Inc.; Contact Length - Mating: 0.130" (3.30mm); Current Rating (Amps): 2A; Material Flammability Rating: UL94 V-0; Number of Positions: 2; Number of Positions Loaded: All; Pitch - Mating: 0.079" (2.00mm); Shrouding: Shrouded - 4 Wall; Style: Board to Cable/Wire; Voltage Rating: 100V; Part Number: S2B-PH-SM4-TB(LF)(SN); ComponentLink1Description: Datasheet; ComponentLink1URL: http://www.jst-mfg.com/product/pdf/eng/ePH.pdf; ComponentLink2Description: DigiKey Link; ComponentLink2URL: http://digikey.com/product-detail/en/jst-sales-america-inc/S2B-PH-SM4-TB-LF-SN/455-1749-1-ND/926846; Connector Type: Header; Contact Finish - Mating: Tin; Contact Finish - Post: Tin; Contact Material: Copper Alloy; Contact Shape: Square; Contact Type: Male Pin; Fastening Type: Detent Lock; Features: Solder Retention; Insulation Color: Natural; Insulation Height: 0.217" (5.51mm); Insulation Material: Polyamide (PA6T), Nylon 6T; LastUpdated: 2020-01-15 03:45:11; Lifecycle Status: Active; Minimum Order: 1; Mounting Type: Surface Mount, Right Angle; Number of Rows: 1; Operating Temperature: -25°C ~ 85°C; Packaging: TapeAndReel; PartId: 115; Part Status: Active; Price: 0.27; Series: PH; Supplier 1: DigiKey; Supplier Part Number 1: 455-1749-1-ND; Termination: Solder
J3 = HIRO TYPE-C-31-M-12: CONN USB 2.0 TYPE-C R/A SMT; Manufacturer: Hiro; Number Of Positions: 12; Part Number: HCTL HC-TYPE-C-16P-01A; PartId: 9703; Supplier 1: LCSC; Supplier Part Number 1: C165948; ComponentLink1Description: Datasheet; ComponentLink1URL: https://datasheet.lcsc.com/szlcsc/1811131825_Korean-Hroparts-Elec-TYPE-C-31-M-12_C165948.pdf; ComponentLink2Description: LCSC Listing; ComponentLink2URL: https://lcsc.com/product-detail/USB-Type-C_Korean-Hroparts-Elec-TYPE-C-31-M-12_C165948.html; Type: USB - C; Series: USB 3.0
J5 = Header 2: Pico-EZmate Wire-to-Board Header Vertical Housing Height 1.55mm with Side Friction Locks 2 Circuits; Manufacturer: Molex; Manufacturer Part Number: 78171-0002; Contact Resistance: 20mR; Number of Contacts: 2; Max Voltage Rating (DC): 5.05kV; Current Rating: 1.5A; Voltage Rating (AC): 50V; Gender: Male; Pitch: 1.2mm; Glow Wire Compliant: Non-compliant; Supplier 1: Mouser; Supplier Part Number 1: 538-78171-0002; RoHS: Yes; Category: Headers and Wire Housings; Stock 1: 144410; Pricing 1: 1=0.39, 10=0.302, 50=0.302, 100=0.225, 1000=0.179, 10000=0.139 (USD); Mounting Technology: Surface Mount; Contact Plating: Gold; Contact Material: Copper Alloy,Copper,Gold; Housing Material: Liquid Crystal Polymer; Min Operating Temperature: -25°C; Max Operating Temperature: 85°C; Number of Rows: 1; Packaging: Tape and Reel; Termination: Solder; Orientation: Vertical; Contact Gender: Female; Voltage Rating: 50V; Number of Positions: 2; Series: Pico-Ezmate; Package Quantity: 36000; Number of Circuits: 2; RoHS Compliant: Yes; Reach SVHC Compliant: Unknown; Halogen Free: Low Halogen
JP4 = SolderJumper_2_Bridged: ki_keywords: solder jumper SPST; ki_description: Solder Jumper, 2-pole, closed/bridged; ki_fp_filters: SolderJumper*Bridged*; Supplier: ~
R45 R48 = RC0402JR-0710KL: as R2 on sheet RP2040; Value: 10k; Part Number: RC0402JR-0710KL; PartId: 14464; Supplier 1: Digi-Key; Supplier Part Number 1: 311-10KJRTR-ND; ComponentLink1Description: Datasheet; ComponentLink1URL: http://www.yageo.com/documents/recent/PYu-RC_Group_51_RoHS_L_04.pdf; ComponentLink2Description: Digi-Key Listing; ComponentLink2URL: https://www.digikey.com/product-detail/en/yageo/RC0402JR-0710KL/311-10KJRTR-ND/726418; Tolerance: 5%; Price: 0,0017; Device Package: 0402 (1005 Metric)
R46 R51 = ERJ-3GEYJ103V: RES SMD 10K OHM 5% 1/10W 0603; Manufacturer: Panasonic Electronic Components; TemperatureRange: -55C ~ 155C; TemperatureCoefficient: 200ppm/C; PowerRating: 0.1W, 1/10W; Value: 10k; Part Number: ERJ-3GEYJ103V; PartId: 11175; Supplier 1: Digi-Key; Supplier Part Number 1: P10KGTR-ND; ComponentLink1Description: Datasheet; ComponentLink1URL: http://industrial.panasonic.com/www-cgi/jvcr13pz.cgi?E+PZ+3+AOA0001+ERJ3GEYJ103V+7+WW; ComponentLink2Description: Digi-Key Listing; ComponentLink2URL: https://www.digikey.com/product-detail/en/panasonic-electronic-components/ERJ-3GEYJ103V/P10KGTR-ND/135662; Tolerance: 5%; Price: 0,002; Device Package: 0603 (1608 Metric)
R47 R50 = RC0402JR-075K1L: RES SMD 5.1K OHM 5% 1/16W 0402; Manufacturer: Yageo; TemperatureRange: -55C ~ 155C; TemperatureCoefficient: 100ppm/C; PowerRating: 0.063W, 1/16W; Value: 5.1k; Part Number: RC0402JR-075K1L; PartId: 14528; Supplier 1: Digi-Key; Supplier Part Number 1: 311-5.1KJRTR-ND; ComponentLink1Description: Datasheet; ComponentLink1URL: http://www.yageo.com/documents/recent/PYu-RC_Group_51_RoHS_L_04.pdf; ComponentLink2Description: Digi-Key Listing; ComponentLink2URL: https://www.digikey.com/product-detail/en/yageo/RC0402JR-075K1L/311-5.1KJRTR-ND/726487; Tolerance: 5%; Price: 0,0017; Device Package: 0402 (1005 Metric)
R49 = RC0402JR-07100RL: RES SMD 100 OHM 5% 1/16W 0402; Manufacturer: Yageo; TemperatureRange: -55C ~ 155C; TemperatureCoefficient: 100ppm/C; PowerRating: 0.063W, 1/16W; Value: 100; Part Number: RC0402JR-07100RL; PartId: 14478; Supplier 1: Digi-Key; Supplier Part Number 1: 311-100JRTR-ND; ComponentLink1Description: Datasheet; ComponentLink1URL: http://www.yageo.com/documents/recent/PYu-RC_Group_51_RoHS_L_04.pdf; ComponentLink2Description: Digi-Key Listing; ComponentLink2URL: https://www.digikey.com/product-detail/en/yageo/RC0402JR-07100RL/311-100JRTR-ND/726415; Tolerance: 5%; Price: 0,0017; Device Package: 0402 (1005 Metric)
R52 = RC0402JR-072KL: RES SMD 2K OHM 5% 1/16W 0402; Manufacturer: Yageo; TemperatureRange: -55C ~ 155C; TemperatureCoefficient: 100ppm/C; PowerRating: 0.063W, 1/16W; Value: 2k; Part Number: RC0402JR-072KL; PartId: 14511; Supplier 1: Digi-Key; Supplier Part Number 1: 311-2.0KJRTR-ND; ComponentLink1Description: Datasheet; ComponentLink1URL: http://www.yageo.com/documents/recent/PYu-RC_Group_51_RoHS_L_04.pdf; ComponentLink2Description: Digi-Key Listing; ComponentLink2URL: https://www.digikey.com/product-detail/en/yageo/RC0402JR-072KL/311-2.0KJRTR-ND/726434; Tolerance: 5%; Price: 0,0017; Device Package: 0402 (1005 Metric)
R53 = RC0402JR-071RL: RES SMD 1 OHM 5% 1/16W 0402; Manufacturer: Yageo; TemperatureRange: -55C ~ 155C; TemperatureCoefficient: 200ppm/C; PowerRating: 0.063W, 1/16W; Value: 1; Part Number: RC0402JR-071RL; PartId: 14504; Supplier 1: Digi-Key; Supplier Part Number 1: 311-1.0JRTR-ND; ComponentLink1Description: Datasheet; ComponentLink1URL: http://www.yageo.com/documents/recent/PYu-RC_Group_51_RoHS_L_04.pdf; ComponentLink2Description: Digi-Key Listing; ComponentLink2URL: https://www.digikey.com/product-detail/en/yageo/RC0402JR-071RL/311-1.0JRTR-ND/726407; Tolerance: 5%; Price: 0,0017; Device Package: 0402 (1005 Metric)
U2 = XC6206-3.3NR: MPN: XC6206-3.3NR

## Sheet Interface.SchDoc
size A3; Author: Alptron AB; CompanyName: Alptron AB; DrawnBy: Caner Alp; Engineer: Caner Alp; Organization: Alptron AB; Address2: Vaesteas; Address4: Sweden; DocumentNumber: 4; SheetNumber: 4; SheetTotal: 5
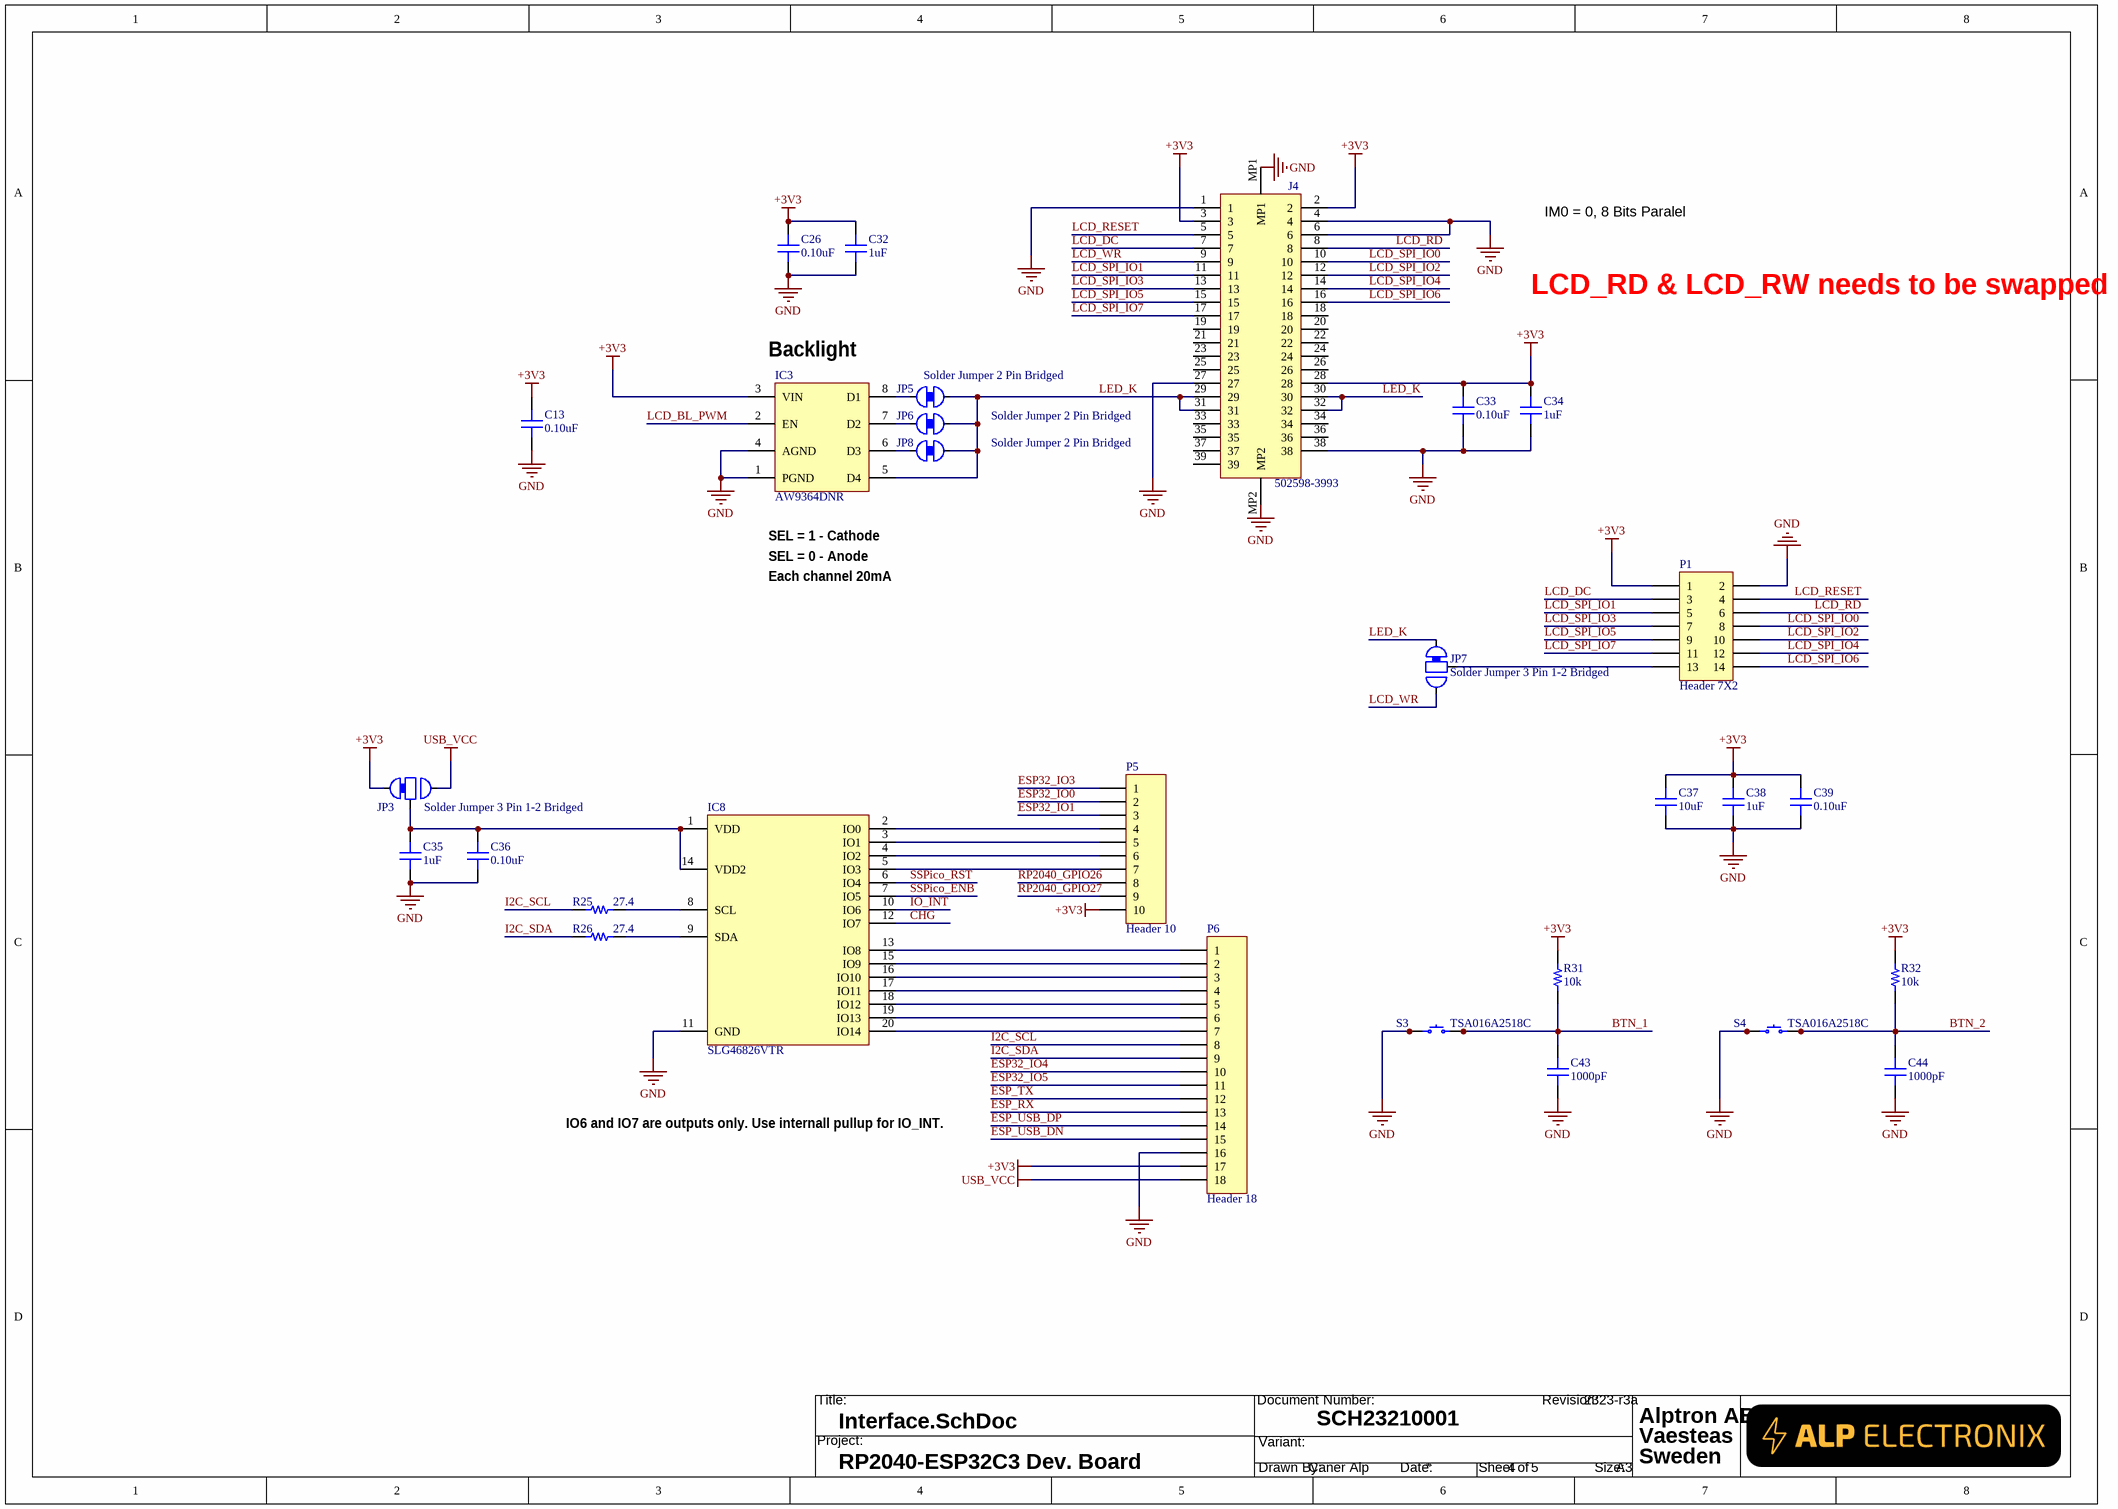
[diagram p3: Interface.SchDoc]

### Parts
C13  0.10uF  [CAP 0402/1005]
C26  0.10uF  [CAP 0402/1005]
C32  1uF  [CAP 0402/1005]
C33  0.10uF  [CAP 0402/1005]
C34  1uF  [CAP 0402/1005]
C35  1uF  [CAP 0402/1005]
C36  0.10uF  [CAP 0402/1005]
C37  10uF  [CAP 0603/1608]
C38  1uF  [CAP 0402/1005]
C39  0.10uF  [CAP 0402/1005]
C43  1000pF  [CAP 0402/1005]
C44  1000pF  [CAP 0402/1005]
IC3  AW9364DNR  [MAXIM TDFN-8 2x2MM]
IC8  SLG46826VTR  [SLG46826VTR]
J4  502598-3993  [5025983993]
JP3  Solder Jumper 3 Pin 1-2 Bridged  [SolderJumper-3_P1.3mm_Bridged12_RoundedPad1.0x1.5mm]  (net tie, no BOM)
JP5  Solder Jumper 2 Pin Bridged  [SolderJumper-2_P1.3mm_Bridged_RoundedPad1.0x1.5mm]  (net tie, no BOM)
JP6  Solder Jumper 2 Pin Bridged  [SolderJumper-2_P1.3mm_Bridged_RoundedPad1.0x1.5mm]  (net tie, no BOM)
JP7  Solder Jumper 3 Pin 1-2 Bridged  [SolderJumper-3_P1.3mm_Bridged12_RoundedPad1.0x1.5mm]  (net tie, no BOM)
JP8  Solder Jumper 2 Pin Bridged  [SolderJumper-2_P1.3mm_Bridged_RoundedPad1.0x1.5mm]  (net tie, no BOM)
P1  Header 7X2  [HDR2X7]
P5  Header 10  [Female Header 2.54mm - 10 Pin]
P6  Header 18  [Female Header 2.54mm - 18 Pin]
R25  27.4  [RES 0402/1005]
R26  27.4  [RES 0402/1005]
R31  10k  [RES 0402/1005]
R32  10k  [RES 0402/1005]
S3  TSA016A2518C  [TSA016A2518C]
S4  TSA016A2518C  [TSA016A2518C]

### Nets
+3V3: C13.2 C26.2 C32.2 C33.2 C34.2 C37.2 C38.2 C39.2 IC3.3(VIN) J4.2 J4.3 J4.28 JP3.1(A) P1.1 P5.10 P6.17 R31.2 R32.2
GND: C13.1 C26.1 C32.1 C33.1 C34.1 C35.1 C36.1 C37.1 C38.1 C39.1 C43.1 C44.1 IC3.1(PGND) IC3.4(AGND) IC8.11(GND) J4.1 J4.4 J4.6 J4.27 J4.38 J4.MP1 J4.MP2 P1.2 P6.16 S3.1 S3.2 S4.1 S4.2
USB_VCC: JP3.3(B) P6.18
BTN_1: C43.2 R31.1 S3.3 S3.4
BTN_2: C44.2 R32.1 S4.3 S4.4
CHG: IC8.12(IO7)
ESP32_IO0: P5.2
ESP32_IO1: P5.3
ESP32_IO3: P5.1
ESP32_IO4: P6.10
ESP32_IO5: P6.11
ESP_RX: P6.13
ESP_TX: P6.12
ESP_USB_DN: P6.15
ESP_USB_DP: P6.14
I2C_SCL: P6.8 R25.1
I2C_SDA: P6.9 R26.1
IO_INT: IC8.10(IO6)
LCD_BL_PWM: IC3.2(EN)
LCD_DC: J4.7 P1.3
LCD_RD: J4.8 P1.6
LCD_RESET: J4.5 P1.4
LCD_SPI_IO0: J4.10 P1.8
LCD_SPI_IO1: J4.11 P1.5
LCD_SPI_IO2: J4.12 P1.10
LCD_SPI_IO3: J4.13 P1.7
LCD_SPI_IO4: J4.14 P1.12
LCD_SPI_IO5: J4.15 P1.9
LCD_SPI_IO6: J4.16 P1.14
LCD_SPI_IO7: J4.17 P1.11
LCD_WR: J4.9 JP7.3(B)
LED_K: IC3.5(D4) J4.29 J4.30 J4.31 J4.32 JP5.2(B) JP6.2(B) JP7.1(A) JP8.2(B)
RP2040_GPIO26: P5.8
RP2040_GPIO27: P5.9
SSPico_ENB: IC8.7(IO5)
SSPico_RST: IC8.6(IO4)
NetC35_2: C35.2 C36.2 IC8.1(VDD) IC8.14(VDD2) JP3.2(C)
NetIC3_6: IC3.6(D3) JP8.1(A)
NetIC3_7: IC3.7(D2) JP6.1(A)
NetIC3_8: IC3.8(D1) JP5.1(A)
NetIC8_2: IC8.2(IO0) P5.4
NetIC8_3: IC8.3(IO1) P5.5
NetIC8_4: IC8.4(IO2) P5.6
NetIC8_5: IC8.5(IO3) P5.7
NetIC8_8: IC8.8(SCL) R25.2
NetIC8_9: IC8.9(SDA) R26.2
NetIC8_13: IC8.13(IO8) P6.1
NetIC8_15: IC8.15(IO9) P6.2
NetIC8_16: IC8.16(IO10) P6.3
NetIC8_17: IC8.17(IO11) P6.4
NetIC8_18: IC8.18(IO12) P6.5
NetIC8_19: IC8.19(IO13) P6.6
NetIC8_20: IC8.20(IO14) P6.7
NetJP7_2: JP7.2(C) P1.13

Not connected (* = marked no-connect by the designer): J4 18 19 20 21 22 23 24 25 26 33 34 35 36 37 39

### Notes on the sheet
- IM0 = 0, 8 Bits Paralel
- LCD_RD & LCD_RW needs to be swapped
- (near IC3) Backlight
- SEL = 0 - Anode
- (near IC3) SEL = 1 - Cathode
- Each channel 20mA
- IO6 and IO7 are outputs only. Use internall pullup for IO_INT.
- Title:
- Project:
- Document Number:
- Variant:
- Revision:
- Drawn By:
- Date:
- Sheet
- of
- Size:
- A3

### Library data of the parts
C13 C26 C33 C36 C39 = LMK105BJ104KV-F: as C1 on sheet RP2040; Value: 0.10uF; Part Number: LMK105BJ104KV-F; PartId: 12322; Supplier 1: Digi-Key; Supplier Part Number 1: 587-1227-2-ND; ComponentLink1Description: Datasheet; ComponentLink1URL: http://ds.yuden.co.jp/TYCOMPAS/ut/detail.do?productNo=LMK105BJ104KV-F&fileName=LMK105BJ104KV-F_SS&mode=specSheetDownload; ComponentLink2Description: Digi-Key Listing; ComponentLink2URL: https://www.digikey.com/product-detail/en/taiyo-yuden/LMK105BJ104KV-F/587-1227-2-ND/930579; TemperatureCoefficient: X5R; Voltage: 10V; Price: 0,0021; Device Package: 0402 (1005 Metric)
C32 C34 C35 C38 = GRM155R70J105KA12D: as C14 on sheet RP2040; Value: 1uF; Part Number: GRM155R70J105KA12D; PartId: 5157; Supplier 1: Digi-Key; Supplier Part Number 1: 490-10024-2-ND; ComponentLink1Description: Datasheet; ComponentLink1URL: http://www.murata.com/~/media/webrenewal/support/library/catalog/products/capacitor/mlcc/c02e.ashx; ComponentLink2Description: Digi-Key listing; ComponentLink2URL: http://digikey.com/product-detail/en/GRM155R70J105KA12D/490-10024-2-ND/5027109; TemperatureCoefficient: X7R; Voltage: 6.3V; Price: 0,019; Device Package: 0402 (1005 Metric)
C37 = GRM188R60J106ME47D: as C17 on sheet ESP32-C3 Module; Value: 10uF; Part Number: GRM188R60J106ME47D; PartId: 12950; Supplier 1: Digi-Key; Supplier Part Number 1: 490-3896-2-ND; ComponentLink1Description: Datasheet; ComponentLink1URL: http://www.murata.com/~/media/webrenewal/support/library/catalog/products/capacitor/mlcc/c02e.pdf; ComponentLink2Description: Digi-Key Listing; ComponentLink2URL: https://www.digikey.com/product-detail/en/murata-electronics-north-america/GRM188R60J106ME47D/490-3896-2-ND/965910; TemperatureCoefficient: X5R; Voltage: 6.3V; Price: 0,031; Device Package: 0603 (1608 Metric)
C43 C44 = C1005C0G1H102J050BA: as C40 on sheet RP2040; Value: 1000pF; Part Number: C1005C0G1H102J050BA; PartId: 3861; Supplier 1: Digi-Key; Supplier Part Number 1: 445-6846-2-ND; ComponentLink1Description: Datasheet; ComponentLink1URL: https://product.tdk.com/info/en/catalog/datasheets/mlcc_commercial_general_en.pdf; ComponentLink2Description: Digi-Key listing; ComponentLink2URL: http://digikey.com/product-detail/en/C1005C0G1H102J050BA/445-6846-2-ND/2619187; Voltage: 50V; Price: 0,0287; Type: -; Device Package: 0402 (1005 Metric)
IC3 = AW9364DNR: -40℃~+85℃ DFN-8(2x2) LED Drivers ROHS
IC8 = SLG46826VTR: Programmable Mixed Signal Matrix with In-System Programmability 2.048kHz/2.048MHz/25MHz Oscillators 20-Pin STQFN; Manufacturer_Name: Dialog Semiconductor; Manufacturer: Renesas; Datasheet Link: https://componentsearchengine.com/Datasheets/2/SLG46826VTR.pdf; Height: 0.6mm; Manufacturer_Part_Number: SLG46826VTR; Mouser Part Number: 724-SLG46826VTR; Mouser Price/Stock: https://www.mouser.co.uk/ProductDetail/Dialog-Semiconductor/SLG46826VTR?qs=w%2Fv1CP2dgqrVTrYCw9J2sA%3D%3D; Supplier 1: Farnell; Manufacturer Part Number: SLG46826V; RoHS: No; Category: CPLDs - Complex Programming Logic Devices; Stock 1: 3286; Pricing 1: 1=15,12000, 10=12,82000, 50=10,78000, 100=8,74000, 250=8,51000, 500=8,27000, 1000=6,43000, 2500=6,11000 (SEK)
J4 = 502598-3993: Connector; Manufacturer_Name: Molex; Datasheet Link: https://www.molex.com/pdm_docs/sd/5025983993_sd.pdf; Height: 1.63mm; Manufacturer_Part_Number: 502598-3993; Mouser Part Number: 538-502598-3993; Mouser Price/Stock: https://www.mouser.co.uk/ProductDetail/Molex/502598-3993?qs=yd8XiKYcH9m2CHpgP0wV0A%3D%3D
JP3 JP7 = SolderJumper_3_Bridged12: ki_keywords: Solder Jumper SPDT; ki_description: 3-pole Solder Jumper, pins 1+2 closed/bridged; ki_fp_filters: SolderJumper*Bridged12*; Supplier: ~
JP5 JP6 JP8 = SolderJumper_2_Bridged: as JP4 on sheet Power; Supplier: ~
P1 = Header 7X2: Header, 7-Pin, Dual row; LatestRevisionDate: 17-Jul-2002; LatestRevisionNote: Re-released for DXP Platform.; Publisher: Altium Limited
P5 = Header 10: Header, 10-Pin; LatestRevisionDate: 17-Jul-2002; LatestRevisionNote: Re-released for DXP Platform.; Publisher: Altium Limited
P6 = Header 18: Header, 18-Pin; LatestRevisionDate: 17-Jul-2002; LatestRevisionNote: Re-released for DXP Platform.; Publisher: Altium Limited
R25 R26 = ERJ-2RKF27R4X: as R3 on sheet RP2040; Value: 27.4; Part Number: ERJ-2RKF27R4X; PartId: 342; Supplier 1: Digi-Key; Supplier Part Number 1: P27.4LTR-ND; ComponentLink1Description: Datasheet; ComponentLink1URL: http://industrial.panasonic.com/www-cgi/jvcr13pz.cgi?E+PZ+3+AOA0002+ERJ2RKF27R4X+7+WW; ComponentLink2Description: Digikey listing; ComponentLink2URL: http://digikey.com/product-detail/en/ERJ-2RKF27R4X/P27.4LTR-ND/192262; Tolerance: 1%; Price: 0,0043; Type: Thick Film; Device Package: 0402 (1005 Metric)
R31 R32 = RC0402JR-0710KL: as R2 on sheet RP2040; Value: 10k; Part Number: RC0402JR-0710KL; PartId: 14464; Supplier 1: Digi-Key; Supplier Part Number 1: 311-10KJRTR-ND; ComponentLink1Description: Datasheet; ComponentLink1URL: http://www.yageo.com/documents/recent/PYu-RC_Group_51_RoHS_L_04.pdf; ComponentLink2Description: Digi-Key Listing; ComponentLink2URL: https://www.digikey.com/product-detail/en/yageo/RC0402JR-0710KL/311-10KJRTR-ND/726418; Tolerance: 5%; Price: 0,0017; Device Package: 0402 (1005 Metric)
S3 S4 = PTS810 SJM 250 SMTR LFS: as S1 on sheet RP2040; Part Number: TSA016A2518C; Circuit: SPST-NO; ComponentLink1Description: Datasheet; ComponentLink1URL: https://dznh3ojzb2azq.cloudfront.net/products/Tactile/PTS810/documents/datasheet.pdf; ComponentLink2Description: DigiKey Link; ComponentLink2URL: http://digikey.com/product-detail/en/c-k/PTS810-SJM-250-SMTR-LFS/CKN10502CT-ND/4176673; LastUpdated: 2020-04-09 10:00:13; Lifecycle Status: Active; Minimum Order: 1; Mounting Type: Surface Mount; Operating Temperature: -40°C ~ 85°C; Packaging: TapeAndReel; Part Status: Active; Price: 0.16; Series: PTS810; Supplier 1: DigiKey; Supplier Part Number 1: CKN10502CT-ND; Termination Style: J Lead

## Sheet Information.SchDoc
size A3; Author: Alptron AB; CompanyName: Alptron AB; DrawnBy: Caner Alp; Engineer: Caner Alp; Organization: Alptron AB; Address2: Vaesteas; Address4: Sweden; DocumentNumber: 5; SheetNumber: 5; SheetTotal: 5
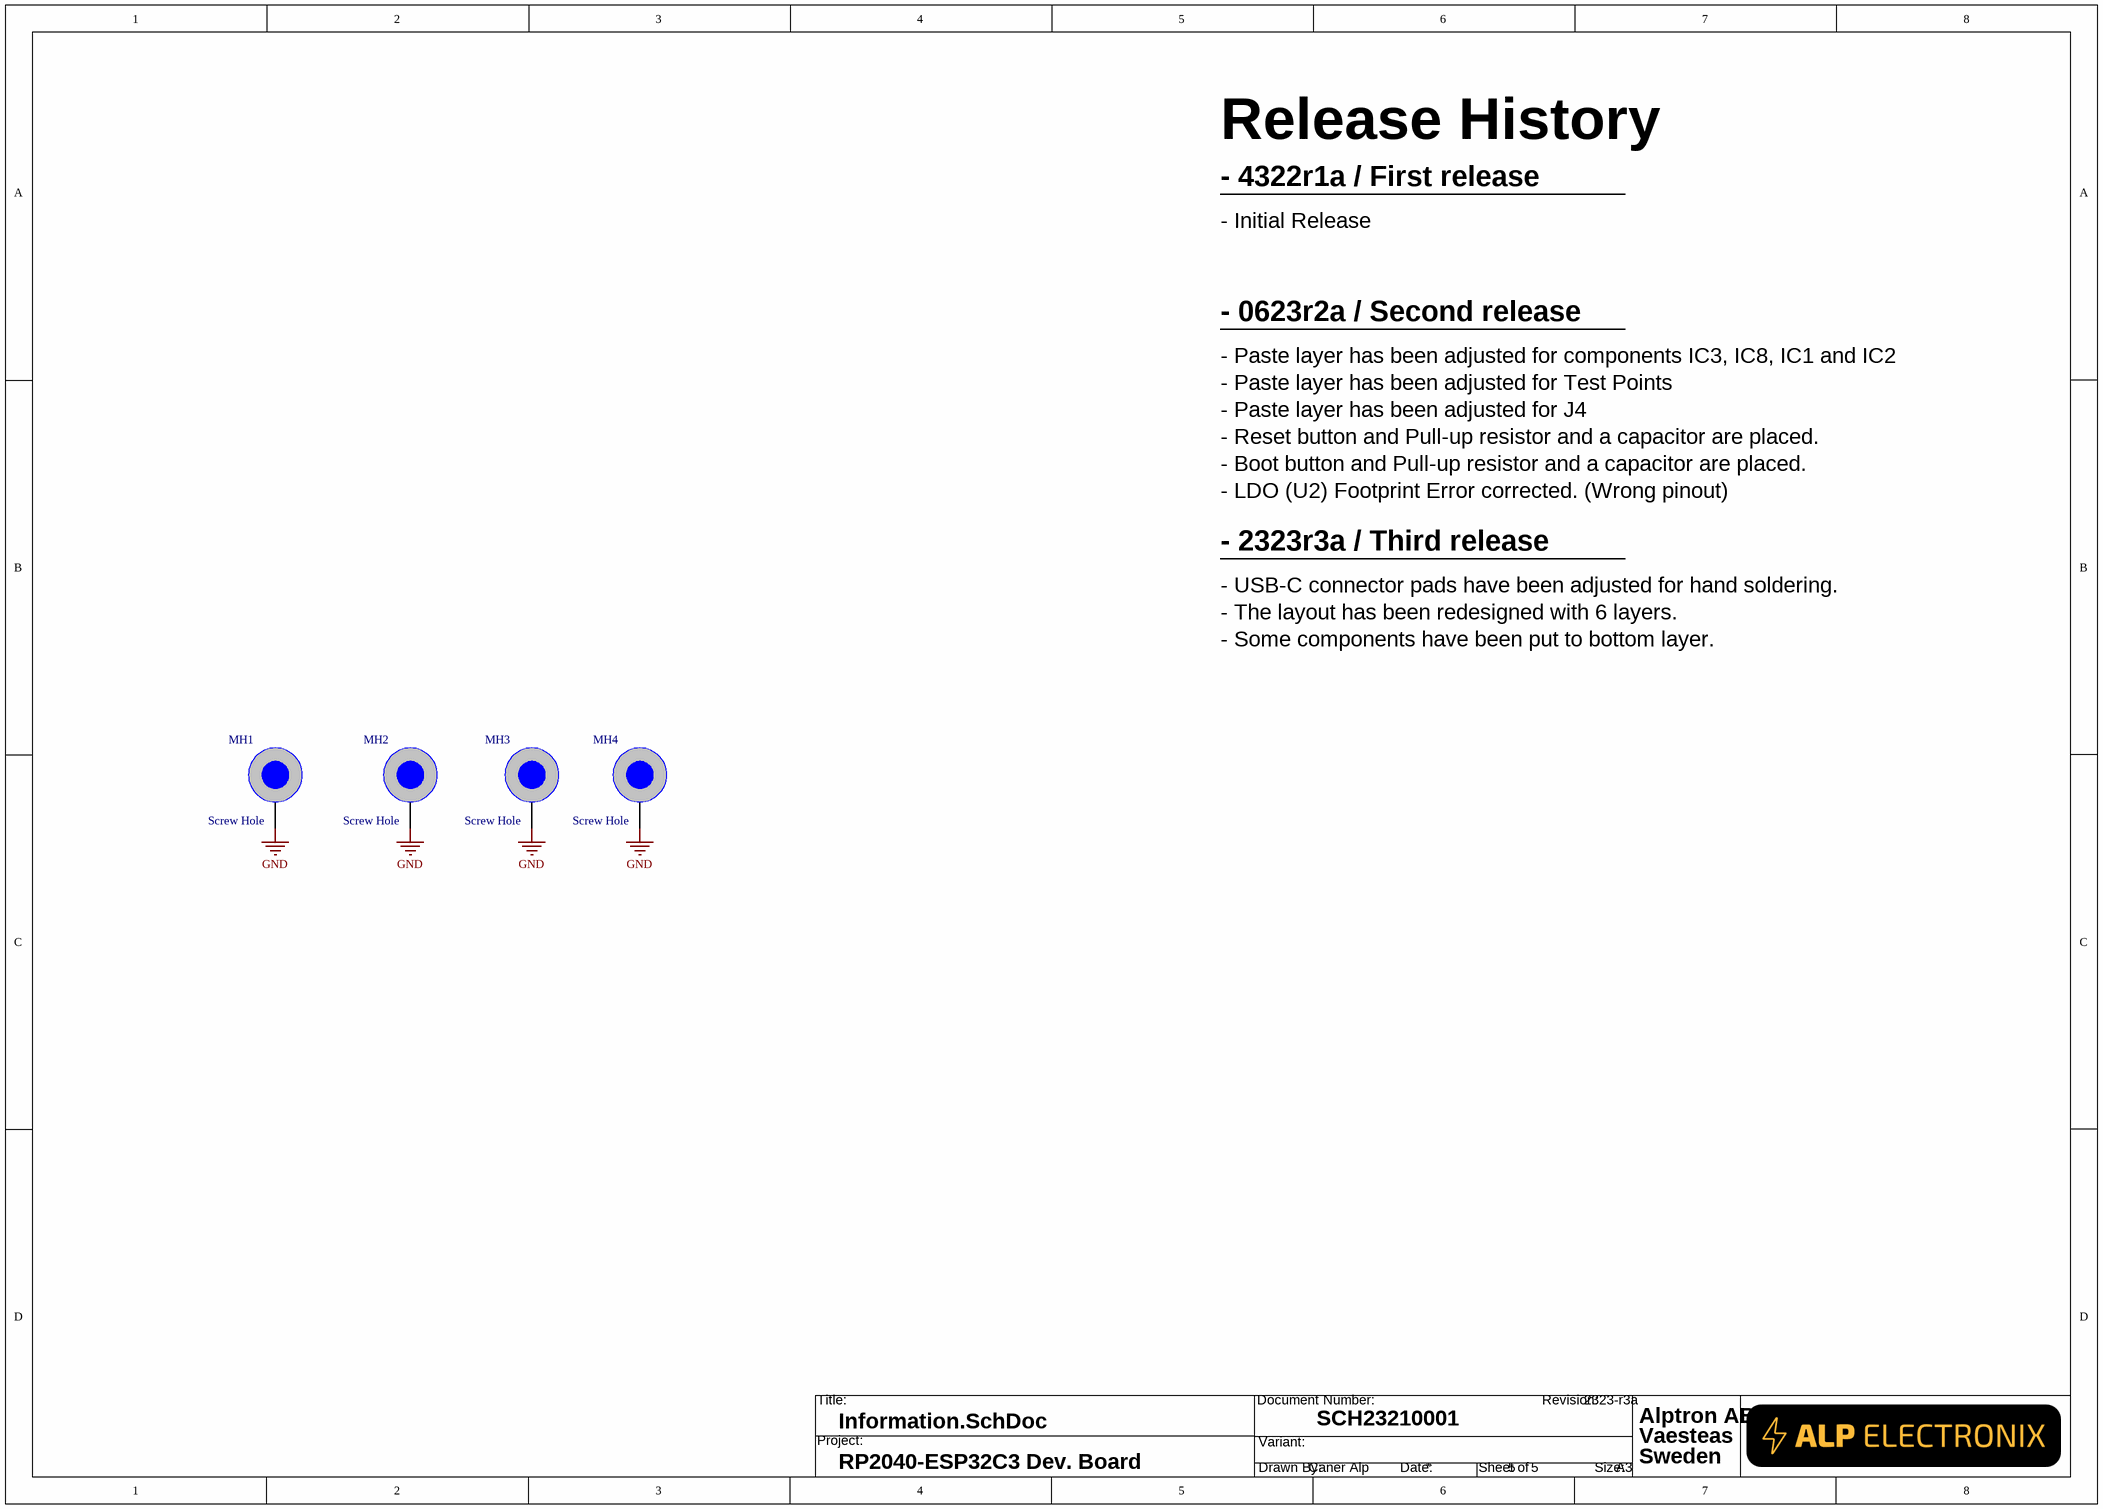
[diagram p4: Information.SchDoc]

### Parts
MH1  Screw Hole  [M3 Screw]  (no BOM)
MH2  Screw Hole  [M3 Screw]  (no BOM)
MH3  Screw Hole  [M3 Screw]  (no BOM)
MH4  Screw Hole  [M3 Screw]  (no BOM)

### Nets
GND: MH1.1 MH2.1 MH3.1 MH4.1

### Notes on the sheet
- Release History
- - 4322r1a / First release
- - Initial Release
- - 0623r2a / Second release
- - Paste layer has been adjusted for components IC3, IC8, IC1 and IC2
- - Paste layer has been adjusted for Test Points
- - Reset button and Pull-up resistor and a capacitor are placed.
- - Paste layer has been adjusted for J4
- - Boot button and Pull-up resistor and a capacitor are placed.
- - LDO (U2) Footprint Error corrected. (Wrong pinout)
- - 2323r3a / Third release
- - USB-C connector pads have been adjusted for hand soldering.
- - The layout has been redesigned with 6 layers.
- - Some components have been put to bottom layer.
- Title:
- Project:
- Document Number:
- Variant:
- Revision:
- Drawn By:
- Date:
- Sheet
- of
- Size:
- A3

## Nets that join several sheets
+3V3: RP2040 (27 pins), ESP32-C3 Module (5 pins), Power (8 pins), Interface (18 pins)
BAT: RP2040 (R24.2), Power (8 pins)
GND: RP2040 (35 pins), ESP32-C3 Module (34 pins), Power (28 pins), Interface (28 pins), Information (MH1.1 MH2.1 MH3.1 MH4.1)
USB_VCC: Power (7 pins), Interface (JP3.3 P6.18)
BTN_1: RP2040 (IC2.30), Interface (C43.2 R31.1 S3.3 S3.4)
BTN_2: RP2040 (IC2.31), Interface (C44.2 R32.1 S4.3 S4.4)
CHG: Power (IC7.1 R52.1), Interface (IC8.12)
ESP32_IO0: ESP32-C3 Module (U1.12), Interface (P5.2)
ESP32_IO1: ESP32-C3 Module (U1.13), Interface (P5.3)
ESP32_IO3: ESP32-C3 Module (U1.6), Interface (P5.1)
ESP32_IO4: ESP32-C3 Module (U1.18), Interface (P6.10)
ESP32_IO5: ESP32-C3 Module (U1.19), Interface (P6.11)
ESP_EN: RP2040 (IC2.32), ESP32-C3 Module (C19.2 R33.1 U1.8)
ESP_RX: ESP32-C3 Module (R42.2), Interface (P6.13)
ESP_RX_RP_TX: RP2040 (IC2.27), ESP32-C3 Module (R36.1)
ESP_TX: ESP32-C3 Module (R43.2), Interface (P6.12)
ESP_TX_RP_RX: RP2040 (IC2.28), ESP32-C3 Module (R37.2)
ESP_USB_DN: ESP32-C3 Module (R41.2), Interface (P6.15)
ESP_USB_DP: ESP32-C3 Module (R40.2), Interface (P6.14)
I2C_SCL: RP2040 (IC2.37 R19.1 TP12.1), Power (A1.3), Interface (P6.8 R25.1)
I2C_SDA: RP2040 (IC2.36 R18.1 TP11.1), Power (A1.4), Interface (P6.9 R26.1)
IO_INT: RP2040 (IC2.29), Interface (IC8.10)
LCD_BL_PWM: RP2040 (IC2.40), Interface (IC3.2)
LCD_DC: RP2040 (R12.1), Interface (J4.7 P1.3)
LCD_RD: RP2040 (R13.1), Interface (J4.8 P1.6)
LCD_RESET: RP2040 (IC2.35 TP7.1), Interface (J4.5 P1.4)
LCD_SPI_IO0: RP2040 (R3.1), Interface (J4.10 P1.8)
LCD_SPI_IO1: RP2040 (R4.1), Interface (J4.11 P1.5)
LCD_SPI_IO2: RP2040 (R5.1), Interface (J4.12 P1.10)
LCD_SPI_IO3: RP2040 (R6.1), Interface (J4.13 P1.7)
LCD_SPI_IO4: RP2040 (R7.1), Interface (J4.14 P1.12)
LCD_SPI_IO5: RP2040 (R8.1), Interface (J4.15 P1.9)
LCD_SPI_IO6: RP2040 (R9.1), Interface (J4.16 P1.14)
LCD_SPI_IO7: RP2040 (R10.1), Interface (J4.17 P1.11)
LCD_WR: RP2040 (R11.1), Interface (J4.9 JP7.3)
RP2040_GPIO26: RP2040 (IC2.38), Interface (P5.8)
RP2040_GPIO27: RP2040 (IC2.39), Interface (P5.9)
SSPico_ENB: Power (A1.2), Interface (IC8.7)
SSPico_RST: Power (A1.7), Interface (IC8.6)
USBX_N: RP2040 (R21.2), Power (D3.2 J3.A7 J3.B7)
USBX_P: RP2040 (R20.2), Power (D3.1 J3.A6 J3.B6)

## Assembly variants
Serial Production No Shunt: not fitted A1 C21 C23 J2 P1 P2 R2 R27
Prototype & Development: not fitted A1 C21 C23